# EAGLE schematic OSHintosh (EAGLE 9.7.0)
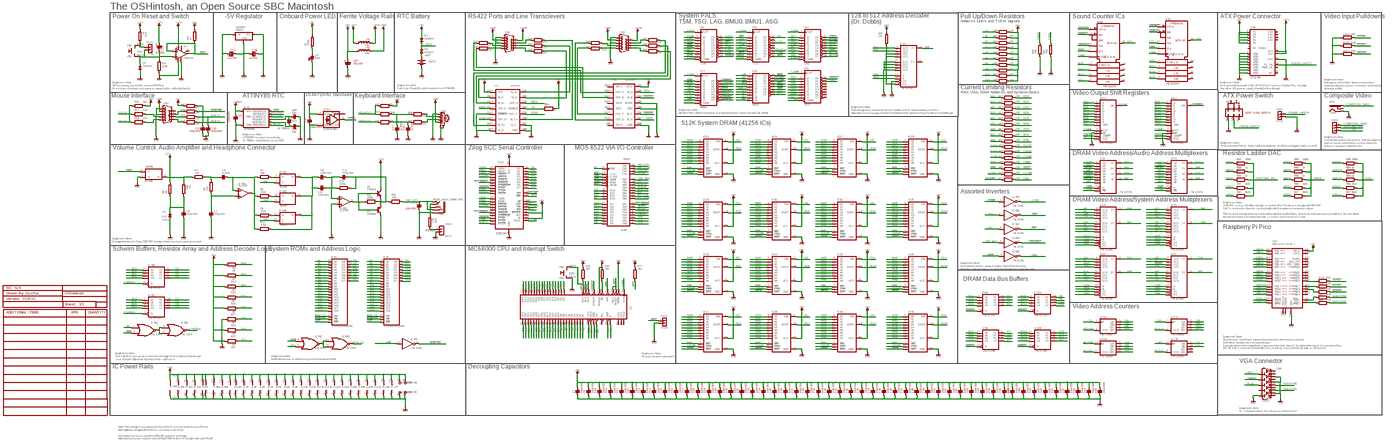
[diagram p0: schematic, sheet 1, overview]
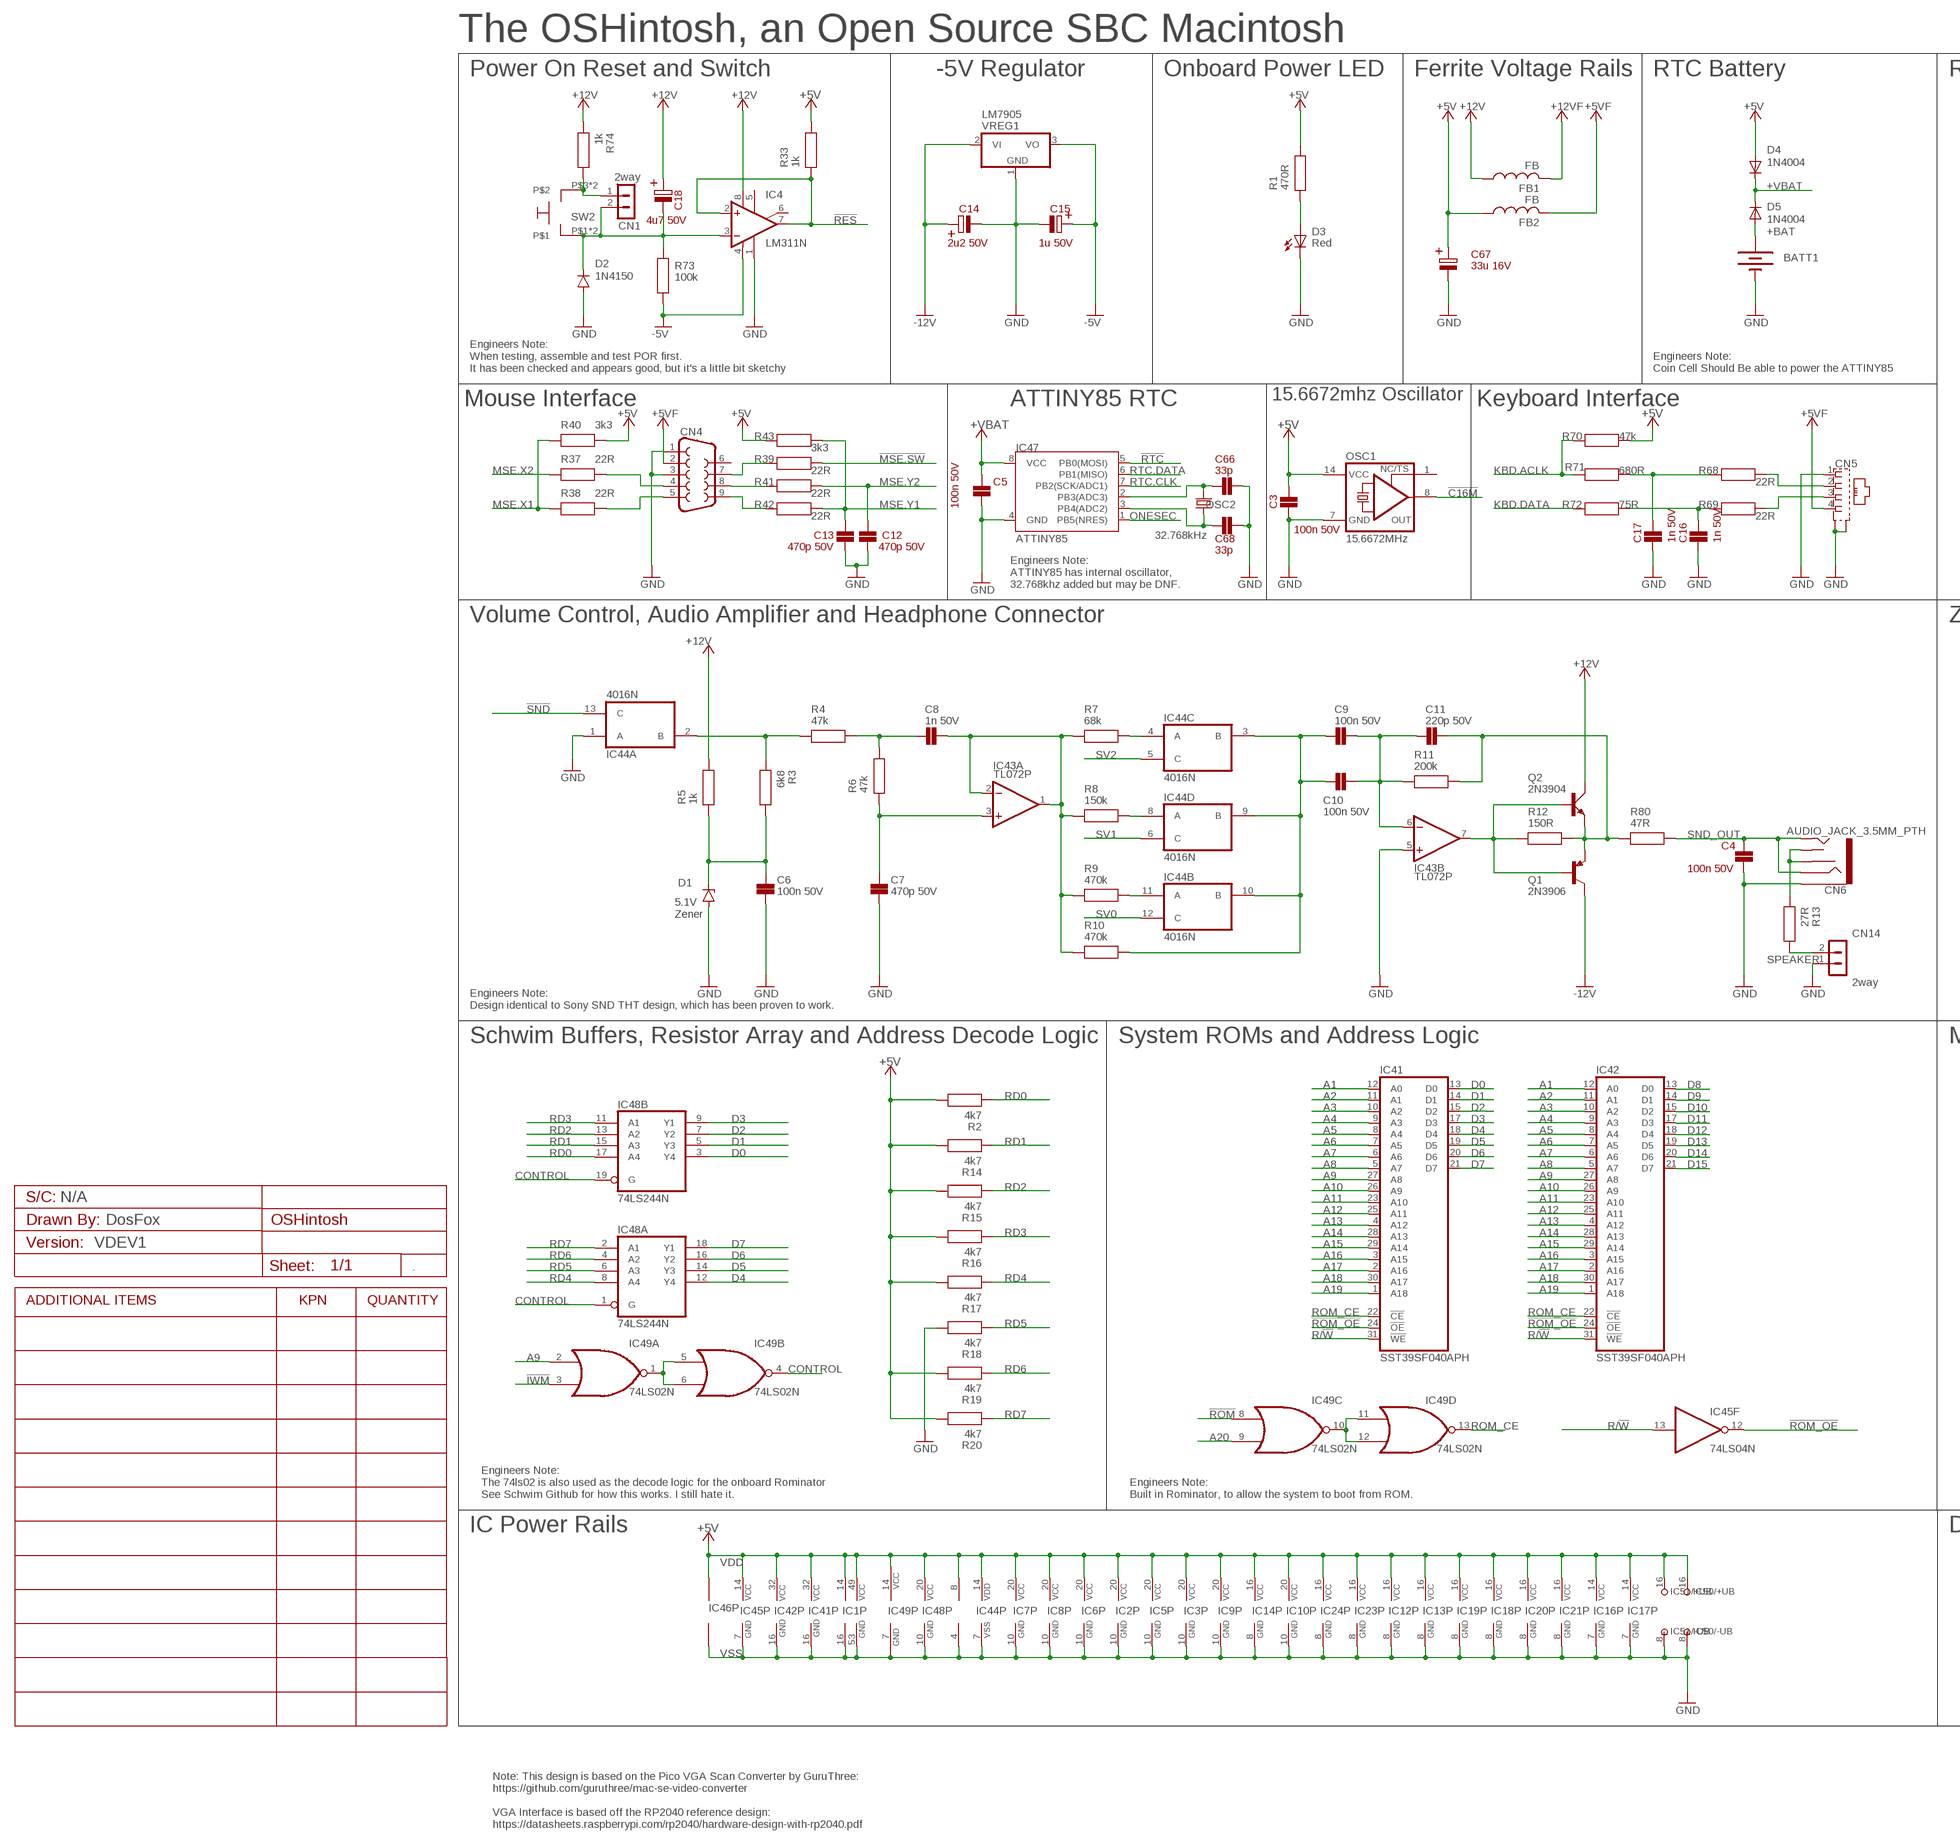
[diagram p1: schematic, sheet 1, part 1 of 4]
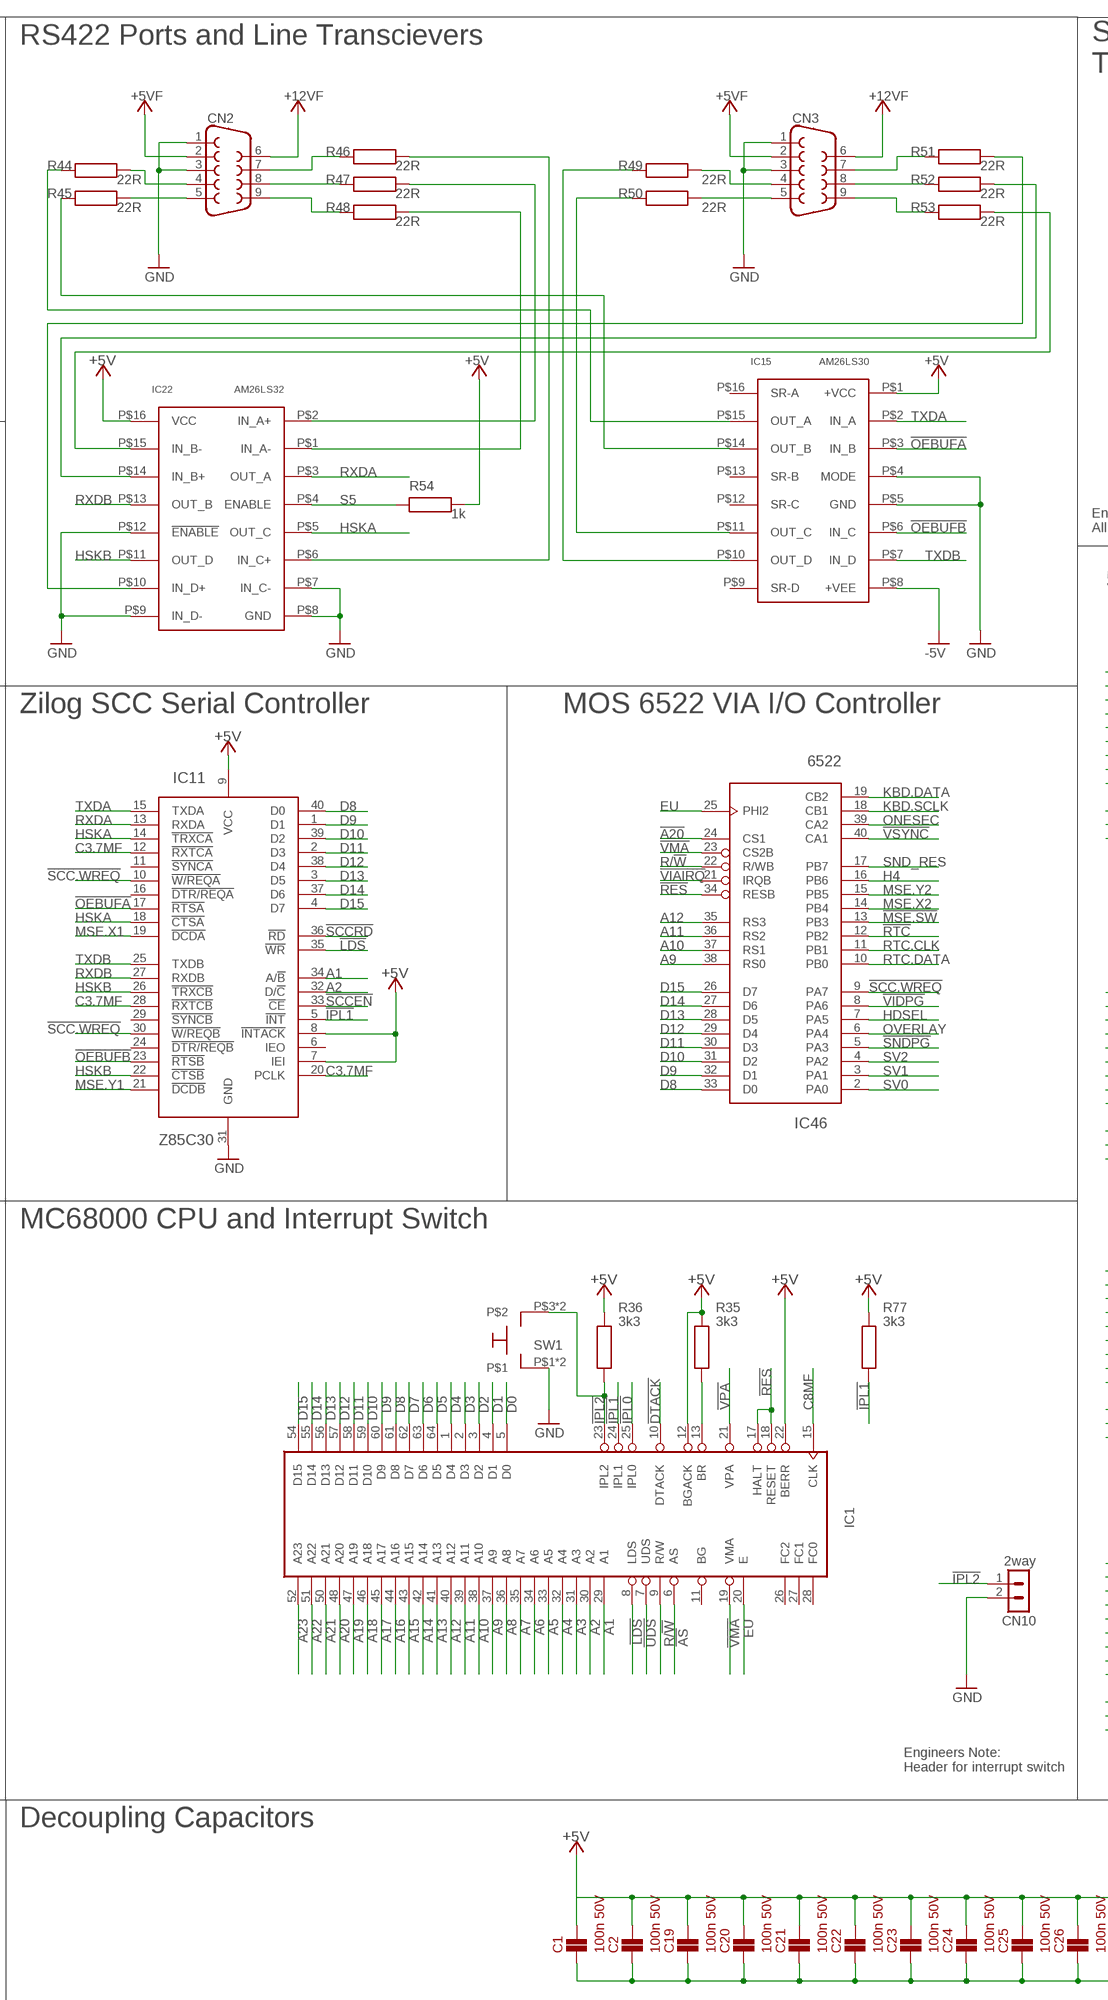
[diagram p2: schematic, sheet 1, part 2 of 4]
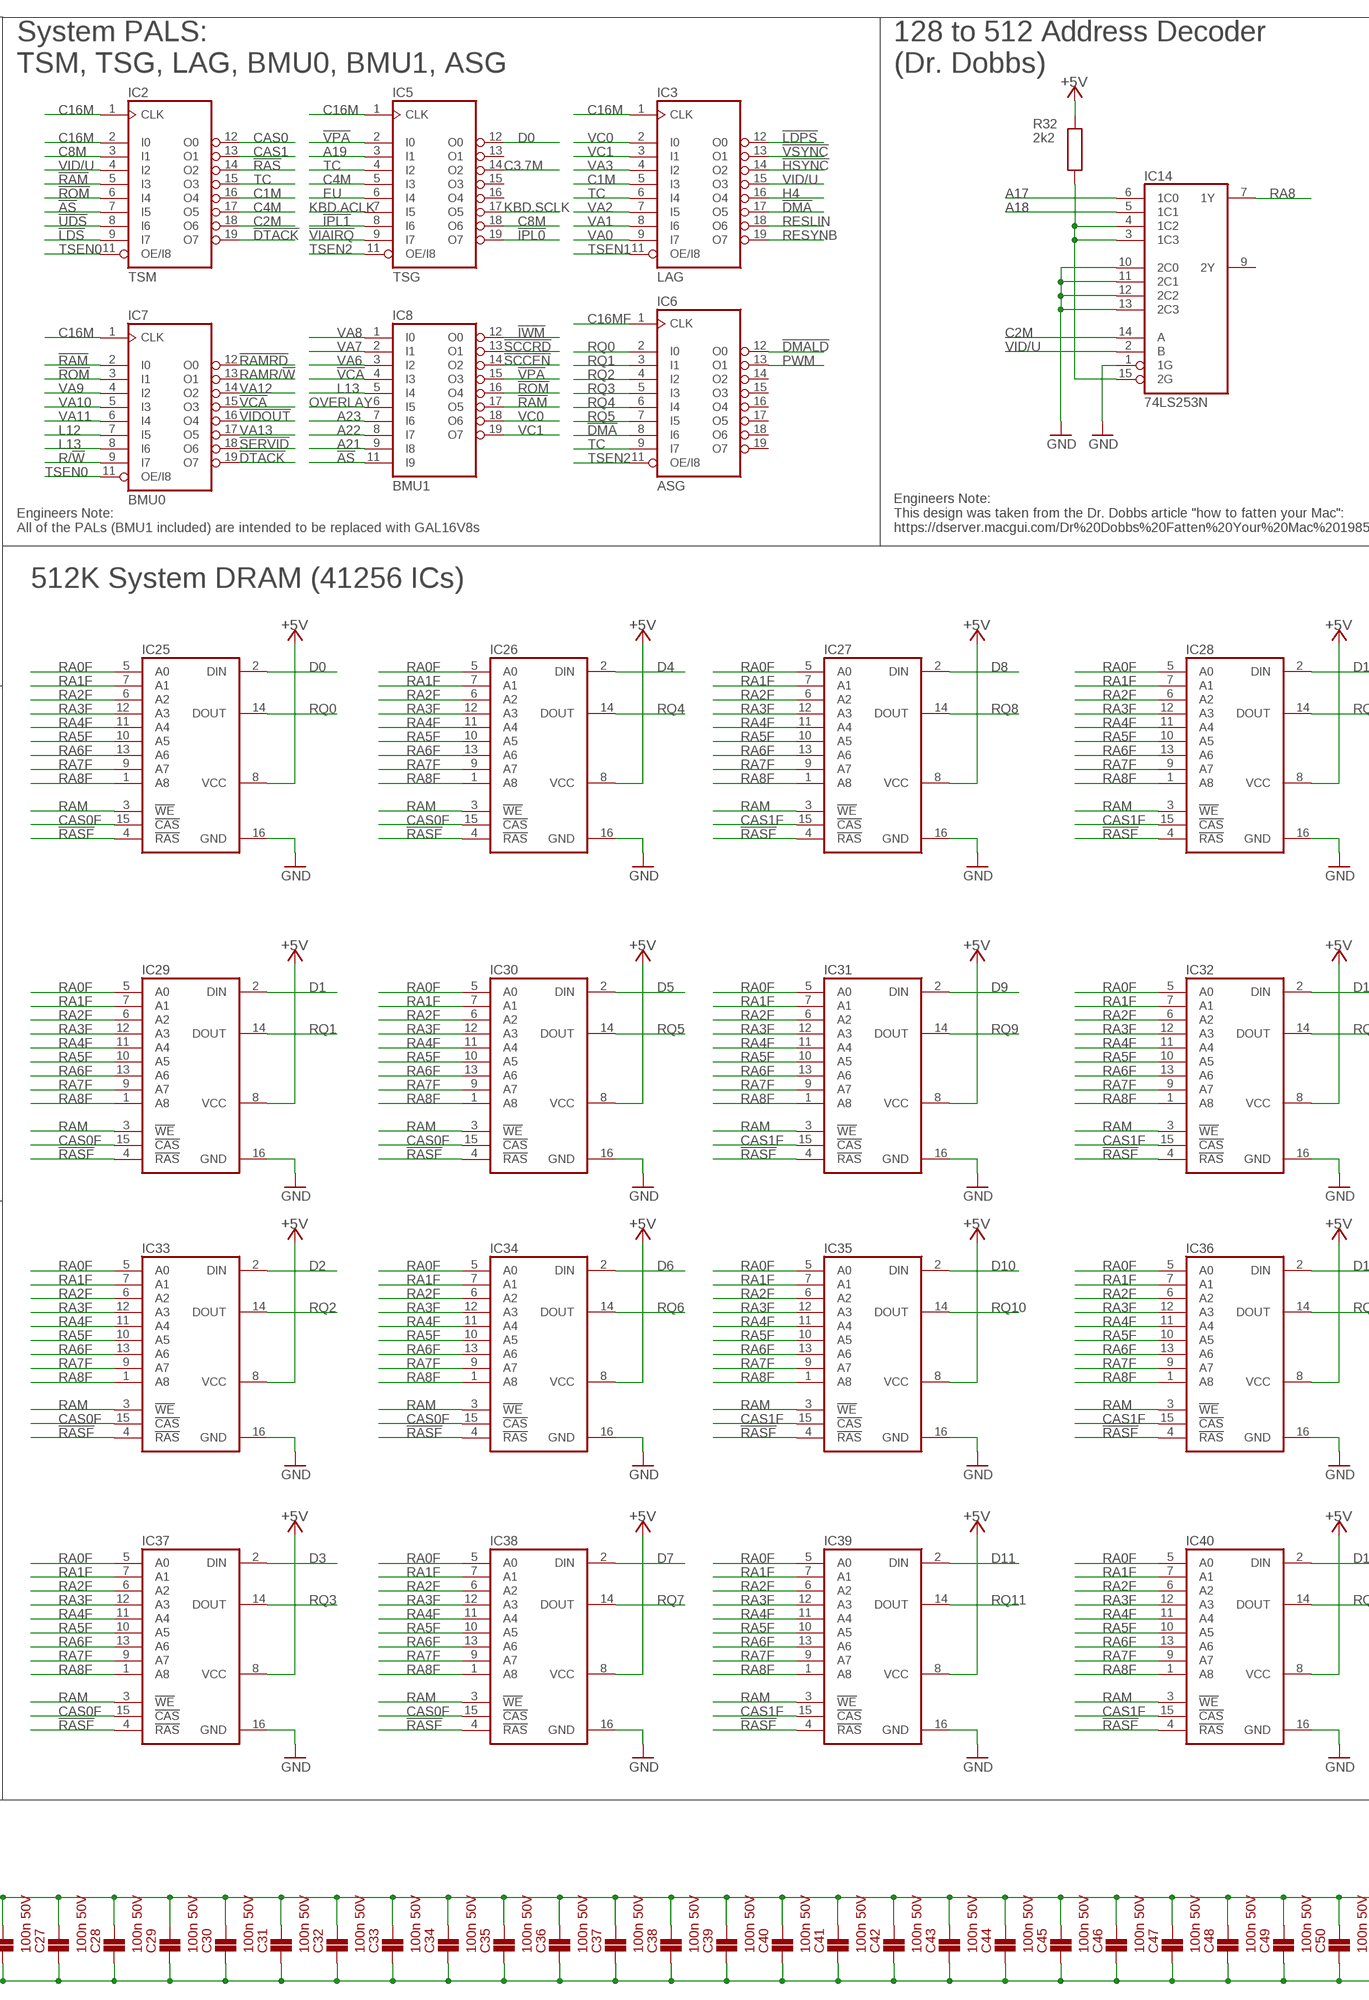
[diagram p3: schematic, sheet 1, part 3 of 4]
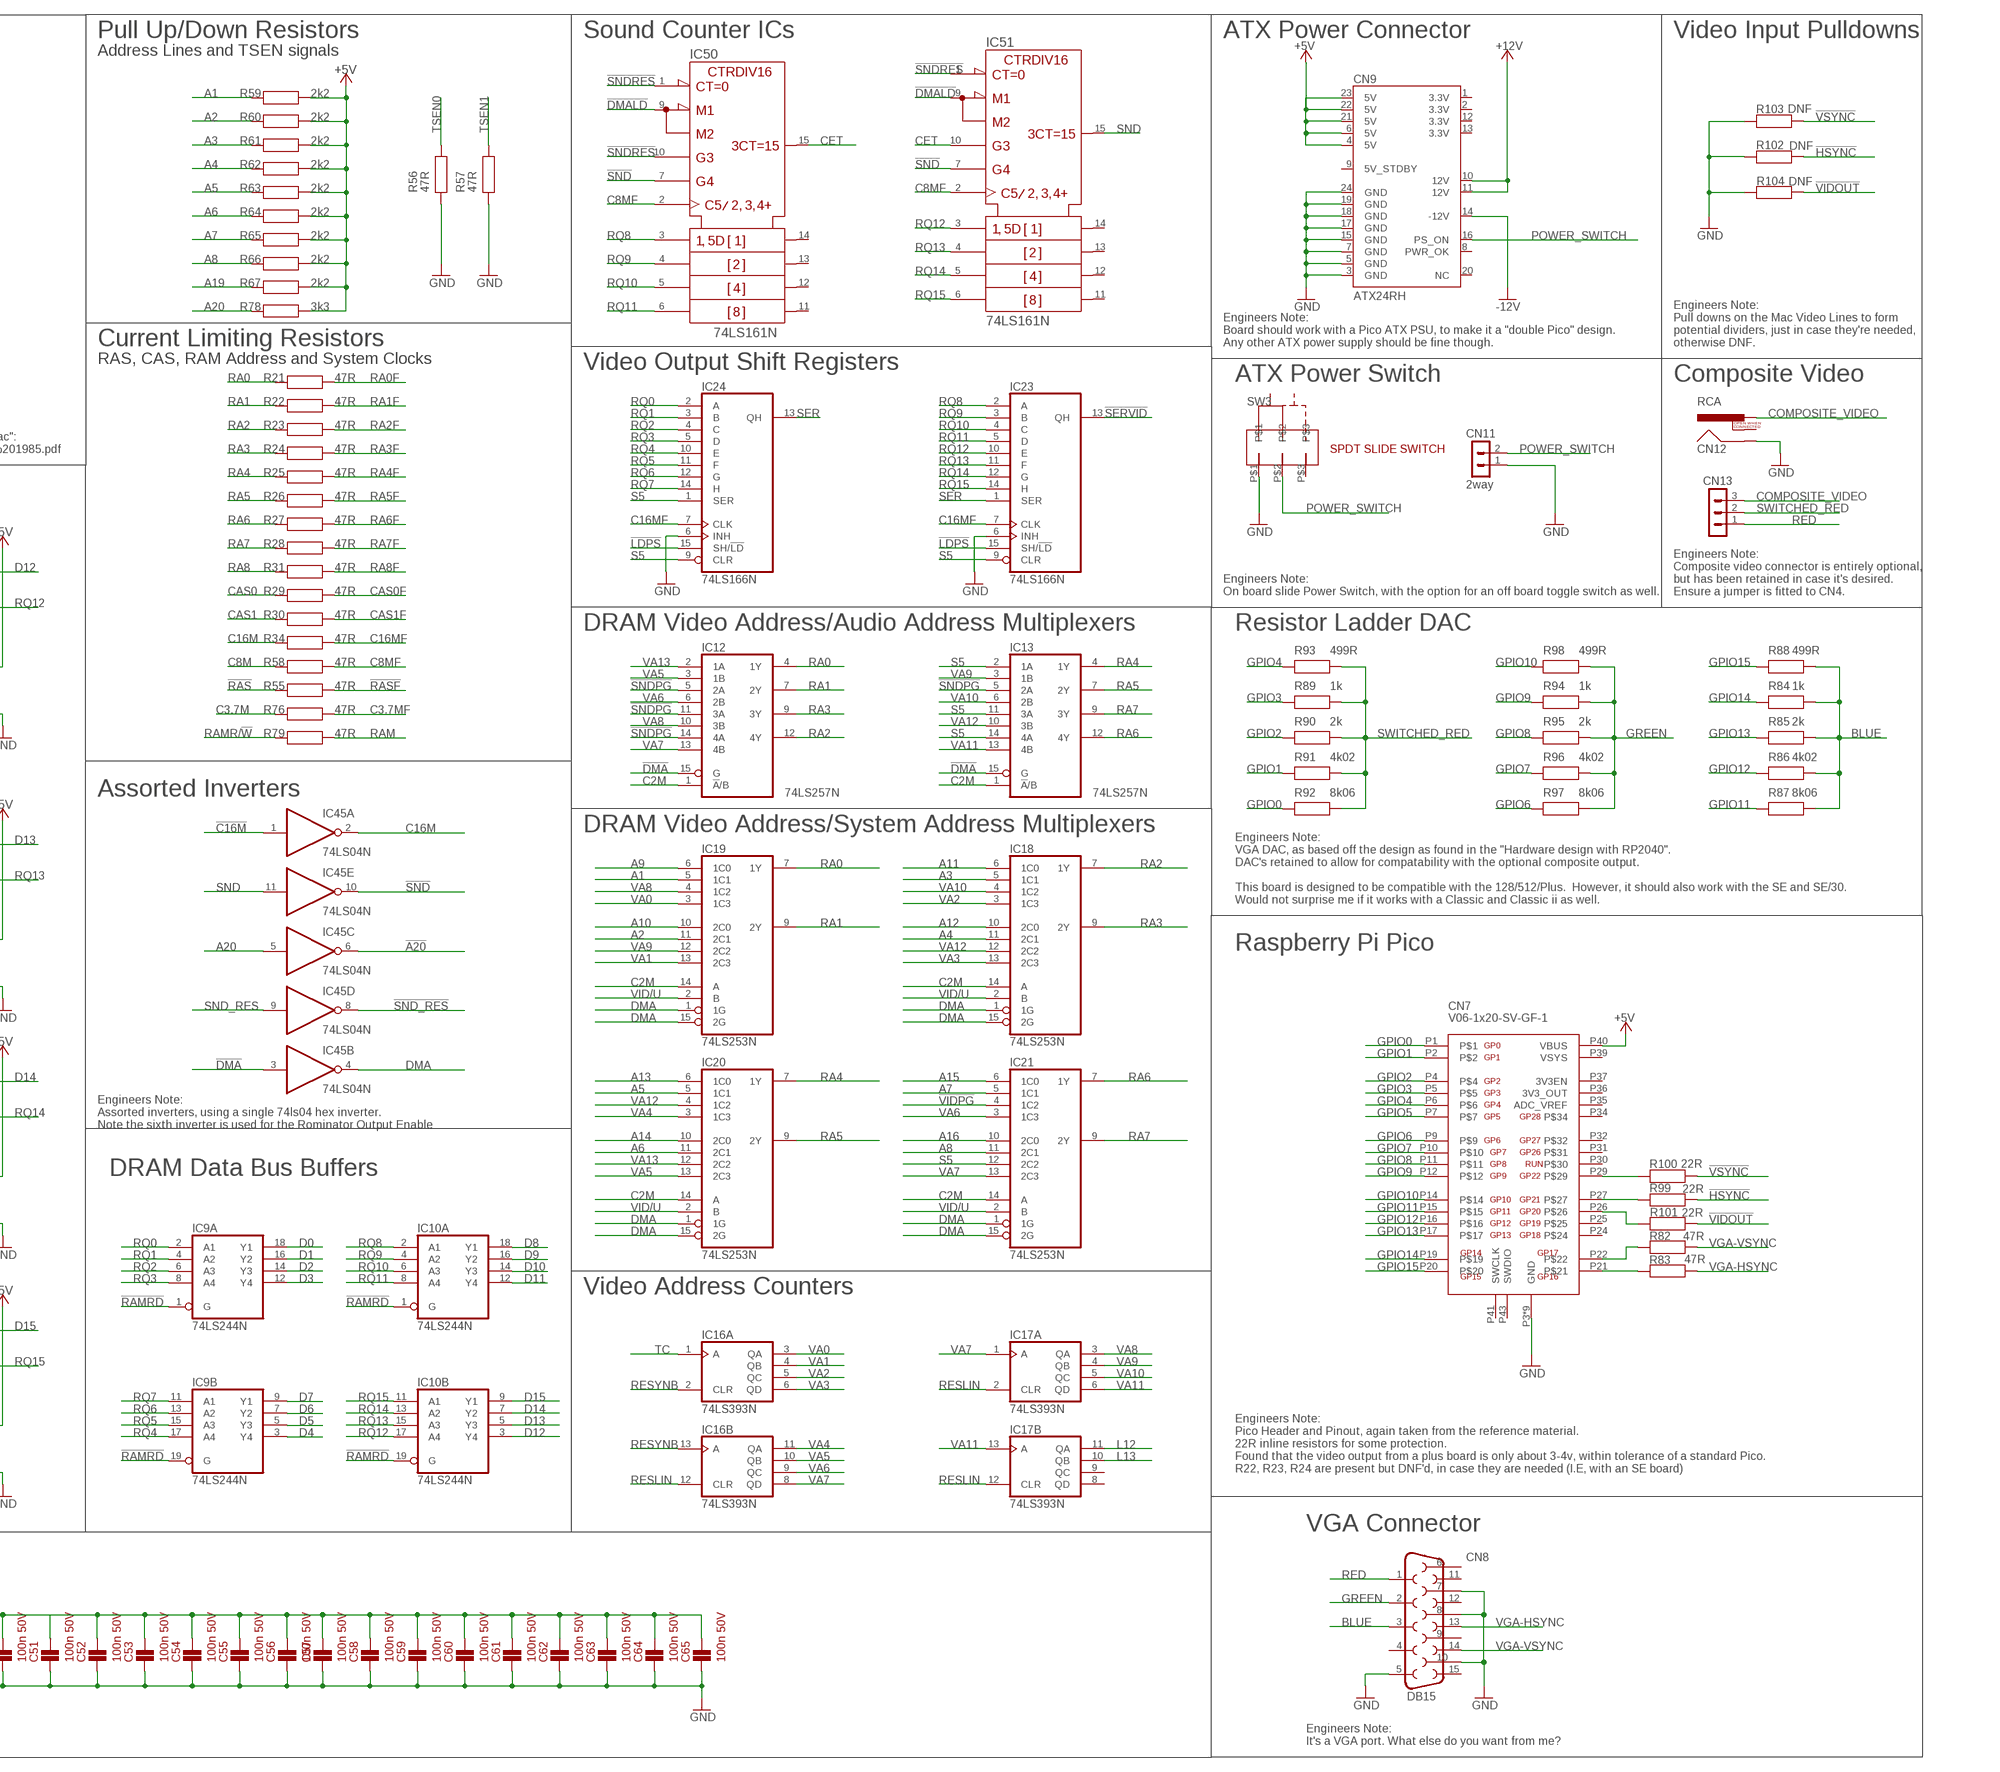
[diagram p4: schematic, sheet 1, part 4 of 4]

## Parts
A1  VDEV1  PROJECT_DETAILS_CUSTOM  [PCB_CUSTOM_DETAILS]
BATT1  BATTERY-20MM_PTH  [BATTCOM_20MM_PTH]
C1  100n 50V  100N_TH_CAP  [CAP_5.08MM_PITCH]
C2  100n 50V  100N_TH_CAP  [CAP_5.08MM_PITCH]
C3  100n 50V  100N_TH_CAP  [CAP_5.08MM_PITCH]
C4  100n 50V  100N_TH_CAP  [CAP_5.08MM_PITCH]
C5  100n 50V  100N_TH_CAP  [CAP_5.08MM_PITCH]
C6  100n 50V  100N_TH_CAP  [CAP_5.08MM_PITCH]
C7  470p 50V  470P_TH_CAP  [CAP_5.08MM_PITCH]
C8  1n 50V  1N_TH_CAP  [CAP_5.08MM_PITCH]
C9  100n 50V  100N_TH_CAP  [CAP_5.08MM_PITCH]
C10  100n 50V  100N_TH_CAP  [CAP_5.08MM_PITCH]
C11  220p 50V  220P_TH_CAP  [CAP_5.08MM_PITCH]
C12  470p 50V  470P_TH_CAP  [CAP_5.08MM_PITCH]
C13  470p 50V  470P_TH_CAP  [CAP_5.08MM_PITCH]
C14  2u2 50V  2U2_TH_ELEC_CAPVERTICAL  [CAP_ELECTROLYTIC]
C15  1u 50V  1U_TH_ELEC_CAPVERTICAL  [CAP_ELECTROLYTIC]
C16  1n 50V  1N_TH_CAP  [CAP_5.08MM_PITCH]
C17  1n 50V  1N_TH_CAP  [CAP_5.08MM_PITCH]
C18  4u7 50V  1U_TH_ELEC_CAPVERTICAL  [CAP_ELECTROLYTIC]
C19  100n 50V  100N_TH_CAP  [CAP_5.08MM_PITCH]
C20  100n 50V  100N_TH_CAP  [CAP_5.08MM_PITCH]
C21  100n 50V  100N_TH_CAP  [CAP_5.08MM_PITCH]
C22  100n 50V  100N_TH_CAP  [CAP_5.08MM_PITCH]
C23  100n 50V  100N_TH_CAP  [CAP_5.08MM_PITCH]
C24  100n 50V  100N_TH_CAP  [CAP_5.08MM_PITCH]
C25  100n 50V  100N_TH_CAP  [CAP_5.08MM_PITCH]
C26  100n 50V  100N_TH_CAP  [CAP_5.08MM_PITCH]
C27  100n 50V  100N_TH_CAP  [CAP_5.08MM_PITCH]
C28  100n 50V  100N_TH_CAP  [CAP_5.08MM_PITCH]
C29  100n 50V  100N_TH_CAP  [CAP_5.08MM_PITCH]
C30  100n 50V  100N_TH_CAP  [CAP_5.08MM_PITCH]
C31  100n 50V  100N_TH_CAP  [CAP_5.08MM_PITCH]
C32  100n 50V  100N_TH_CAP  [CAP_5.08MM_PITCH]
C33  100n 50V  100N_TH_CAP  [CAP_5.08MM_PITCH]
C34  100n 50V  100N_TH_CAP  [CAP_5.08MM_PITCH]
C35  100n 50V  100N_TH_CAP  [CAP_5.08MM_PITCH]
C36  100n 50V  100N_TH_CAP  [CAP_5.08MM_PITCH]
C37  100n 50V  100N_TH_CAP  [CAP_5.08MM_PITCH]
C38  100n 50V  100N_TH_CAP  [CAP_5.08MM_PITCH]
C39  100n 50V  100N_TH_CAP  [CAP_5.08MM_PITCH]
C40  100n 50V  100N_TH_CAP  [CAP_5.08MM_PITCH]
C41  100n 50V  100N_TH_CAP  [CAP_5.08MM_PITCH]
C42  100n 50V  100N_TH_CAP  [CAP_5.08MM_PITCH]
C43  100n 50V  100N_TH_CAP  [CAP_5.08MM_PITCH]
C44  100n 50V  100N_TH_CAP  [CAP_5.08MM_PITCH]
C45  100n 50V  100N_TH_CAP  [CAP_5.08MM_PITCH]
C46  100n 50V  100N_TH_CAP  [CAP_5.08MM_PITCH]
C47  100n 50V  100N_TH_CAP  [CAP_5.08MM_PITCH]
C48  100n 50V  100N_TH_CAP  [CAP_5.08MM_PITCH]
C49  100n 50V  100N_TH_CAP  [CAP_5.08MM_PITCH]
C50  100n 50V  100N_TH_CAP  [CAP_5.08MM_PITCH]
C51  100n 50V  100N_TH_CAP  [CAP_5.08MM_PITCH]
C52  100n 50V  100N_TH_CAP  [CAP_5.08MM_PITCH]
C53  100n 50V  100N_TH_CAP  [CAP_5.08MM_PITCH]
C54  100n 50V  100N_TH_CAP  [CAP_5.08MM_PITCH]
C55  100n 50V  100N_TH_CAP  [CAP_5.08MM_PITCH]
C56  100n 50V  100N_TH_CAP  [CAP_5.08MM_PITCH]
C57  100n 50V  100N_TH_CAP  [CAP_5.08MM_PITCH]
C58  100n 50V  100N_TH_CAP  [CAP_5.08MM_PITCH]
C59  100n 50V  100N_TH_CAP  [CAP_5.08MM_PITCH]
C60  100n 50V  100N_TH_CAP  [CAP_5.08MM_PITCH]
C61  100n 50V  100N_TH_CAP  [CAP_5.08MM_PITCH]
C62  100n 50V  100N_TH_CAP  [CAP_5.08MM_PITCH]
C63  100n 50V  100N_TH_CAP  [CAP_5.08MM_PITCH]
C64  100n 50V  100N_TH_CAP  [CAP_5.08MM_PITCH]
C65  100n 50V  100N_TH_CAP  [CAP_5.08MM_PITCH]
C66  33p  33P_TH_CAP  [CAP_5.08MM_PITCH]
C67  33u 16V  100U_TH_ELEC_CAPVERTICAL  [CAP_ELECTROLYTIC]
C68  33p  33P_TH_CAP  [CAP_5.08MM_PITCH]
CN1  2way  PIN_HEADER_2W_VERT_TH  [2W_2.54MM_PITCH_VERT_TH]
CN2  DB9FEMALE  [DB9]
CN3  DB9FEMALE  [DB9]
CN4  DB9FEMALE  [DB9]
CN5  XRJK-S-01-6-4-0-9M2  [XRJK-S-01-6-4-0-9M2]
CN6  AUDIO_JACK_3.5MM_PTH  [AUDIO-JACK]
CN7  V06-1x20-SV-GF-1  PICO_BOARD  [PICO_SOCKET]
CN8  DB15  [DB15]
CN9  ATX24RH  [ATX24_RIGHT_ANGLE]
CN10  2way  PIN_HEADER_2W_VERT_TH  [2W_2.54MM_PITCH_VERT_TH]
CN11  2way  PIN_HEADER_2W_VERT_TH  [2W_2.54MM_PITCH_VERT_TH]
CN12  RCA  [RCA]
CN13  V06-1x3-SV-GF-1  PIN_HEADER_3W_VERT_FEMALE_TH  [3W_2.54MM_PITCH_VERT_TH]
CN14  2way  PIN_HEADER_2W_VERT_TH  [2W_2.54MM_PITCH_VERT_TH]
D1  ZENER-DIODEF126-10  [F126Z10]
D2  1N4150  1N4148DO35-7  [DO35-7]
D3  Red  5MM_LED_RED  [5MM_TH_VERT_STANDARD]
D4  1N4004  [DO41-10]
D5  1N4004  [DO41-10]
FB1  FB  [FB]
FB2  FB  [FB]
IC1  MC68000P  [DIL64]
IC2  TSM  16V8  [DIL20]
IC3  LAG  16V8  [DIL20]
IC4  LM311N  [DIL08]
IC5  TSG  16V8  [DIL20]
IC6  ASG  16V8  [DIL20]
IC7  BMU0  16V8  [DIL20]
IC8  BMU1  16L8  [DIL20]
IC9  74LS244N  [DIL20]
IC10  74LS244N  [DIL20]
IC11  Z85C30  [DIP40]
IC12  74LS257N  [DIL16]
IC13  74LS257N  [DIL16]
IC14  74LS253N  [DIL16]
IC15  AM26LS30  [DIP16]
IC16  74LS393N  [DIL14]
IC17  74LS393N  [DIL14]
IC18  74LS253N  [DIL16]
IC19  74LS253N  [DIL16]
IC20  74LS253N  [DIL16]
IC21  74LS253N  [DIL16]
IC22  AM26LS32  [DIP16]
IC23  74LS166N  [DIL16]
IC24  74LS166N  [DIL16]
IC25  41256C/D  [DIL16]
IC26  41256C/D  [DIL16]
IC27  41256C/D  [DIL16]
IC28  41256C/D  [DIL16]
IC29  41256C/D  [DIL16]
IC30  41256C/D  [DIL16]
IC31  41256C/D  [DIL16]
IC32  41256C/D  [DIL16]
IC33  41256C/D  [DIL16]
IC34  41256C/D  [DIL16]
IC35  41256C/D  [DIL16]
IC36  41256C/D  [DIL16]
IC37  41256C/D  [DIL16]
IC38  41256C/D  [DIL16]
IC39  41256C/D  [DIL16]
IC40  41256C/D  [DIL16]
IC41  SST39SF040APH  [DIL32]
IC42  SST39SF040APH  [DIL32]
IC43  TL072P  [DIL08]
IC44  4016N  [DIL14]
IC45  74LS04N  [DIL14]
IC46  6522  G65SC22P  [DIP-40]
IC47  ATTINY85  ATTINY45TINY85-20-DIP  [DIP08_MCU]
IC48  74LS244N  [DIL20]
IC49  74LS02N  [DIL14]
IC50  74LS161N  74161N  [DIL16]
IC51  74LS161N  74161N  [DIL16]
OSC1  15.6672MHz  XO-14  [DIL14S]
OSC2  32.768kHz  CRYSTAL-32.768KHZPTH-2X6  [CRYSTAL-PTH-2X6-CYL]
Q1  2N3906  [TO92]
Q2  2N3904  [TO92D]
R1  470R  470R_TH_RESISTOR  [RESISTORTHRUHOLE]
R2  4k7  4K7_TH_RESISTOR  [RESISTORTHRUHOLE]
R3  6k8  6K8_TH_RESISTOR  [RESISTORTHRUHOLE]
R4  47k  47K_TH_RESISTOR  [RESISTORTHRUHOLE]
R5  1k  1K_TH_RESISTOR  [RESISTORTHRUHOLE]
R6  47k  47K_TH_RESISTOR  [RESISTORTHRUHOLE]
R7  68k  68K_TH_RESISTOR  [RESISTORTHRUHOLE]
R8  150k  150K_TH_RESISTOR  [RESISTORTHRUHOLE]
R9  470k  470K_TH_RESISTOR  [RESISTORTHRUHOLE]
R10  470k  470K_TH_RESISTOR  [RESISTORTHRUHOLE]
R11  200k  100K_TH_RESISTOR  [RESISTORTHRUHOLE]
R12  150R  150K_TH_RESISTOR  [RESISTORTHRUHOLE]
R13  27R  10R_TH_RESISTOR  [RESISTORTHRUHOLE]
R14  4k7  4K7_TH_RESISTOR  [RESISTORTHRUHOLE]
R15  4k7  4K7_TH_RESISTOR  [RESISTORTHRUHOLE]
R16  4k7  4K7_TH_RESISTOR  [RESISTORTHRUHOLE]
R17  4k7  4K7_TH_RESISTOR  [RESISTORTHRUHOLE]
R18  4k7  4K7_TH_RESISTOR  [RESISTORTHRUHOLE]
R19  4k7  4K7_TH_RESISTOR  [RESISTORTHRUHOLE]
R20  4k7  4K7_TH_RESISTOR  [RESISTORTHRUHOLE]
R21  47R  47R_TH_RESISTOR  [RESISTORTHRUHOLE]
R22  47R  47R_TH_RESISTOR  [RESISTORTHRUHOLE]
R23  47R  47R_TH_RESISTOR  [RESISTORTHRUHOLE]
R24  47R  47R_TH_RESISTOR  [RESISTORTHRUHOLE]
R25  47R  47R_TH_RESISTOR  [RESISTORTHRUHOLE]
R26  47R  47R_TH_RESISTOR  [RESISTORTHRUHOLE]
R27  47R  47R_TH_RESISTOR  [RESISTORTHRUHOLE]
R28  47R  47R_TH_RESISTOR  [RESISTORTHRUHOLE]
R29  47R  47R_TH_RESISTOR  [RESISTORTHRUHOLE]
R30  47R  47R_TH_RESISTOR  [RESISTORTHRUHOLE]
R31  47R  47R_TH_RESISTOR  [RESISTORTHRUHOLE]
R32  2k2  2K2_TH_RESISTOR  [RESISTORTHRUHOLE]
R33  1k  1K_TH_RESISTOR  [RESISTORTHRUHOLE]
R34  47R  47R_TH_RESISTOR  [RESISTORTHRUHOLE]
R35  3k3  3K3_TH_RESISTOR  [RESISTORTHRUHOLE]
R36  3k3  3K3_TH_RESISTOR  [RESISTORTHRUHOLE]
R37  22R  22R_TH_RESISTOR  [RESISTORTHRUHOLE]
R38  22R  22R_TH_RESISTOR  [RESISTORTHRUHOLE]
R39  22R  22R_TH_RESISTOR  [RESISTORTHRUHOLE]
R40  3k3  3K3_TH_RESISTOR  [RESISTORTHRUHOLE]
R41  22R  22R_TH_RESISTOR  [RESISTORTHRUHOLE]
R42  22R  22R_TH_RESISTOR  [RESISTORTHRUHOLE]
R43  3k3  3K3_TH_RESISTOR  [RESISTORTHRUHOLE]
R44  22R  22R_TH_RESISTOR  [RESISTORTHRUHOLE]
R45  22R  22R_TH_RESISTOR  [RESISTORTHRUHOLE]
R46  22R  22R_TH_RESISTOR  [RESISTORTHRUHOLE]
R47  22R  22R_TH_RESISTOR  [RESISTORTHRUHOLE]
R48  22R  22R_TH_RESISTOR  [RESISTORTHRUHOLE]
R49  22R  22R_TH_RESISTOR  [RESISTORTHRUHOLE]
R50  22R  22R_TH_RESISTOR  [RESISTORTHRUHOLE]
R51  22R  22R_TH_RESISTOR  [RESISTORTHRUHOLE]
R52  22R  22R_TH_RESISTOR  [RESISTORTHRUHOLE]
R53  22R  22R_TH_RESISTOR  [RESISTORTHRUHOLE]
R54  1k  1K_TH_RESISTOR  [RESISTORTHRUHOLE]
R55  47R  47R_TH_RESISTOR  [RESISTORTHRUHOLE]
R56  47R  47R_TH_RESISTOR  [RESISTORTHRUHOLE]
R57  47R  47R_TH_RESISTOR  [RESISTORTHRUHOLE]
R58  47R  47R_TH_RESISTOR  [RESISTORTHRUHOLE]
R59  2k2  2K2_TH_RESISTOR  [RESISTORTHRUHOLE]
R60  2k2  2K2_TH_RESISTOR  [RESISTORTHRUHOLE]
R61  2k2  2K2_TH_RESISTOR  [RESISTORTHRUHOLE]
R62  2k2  2K2_TH_RESISTOR  [RESISTORTHRUHOLE]
R63  2k2  2K2_TH_RESISTOR  [RESISTORTHRUHOLE]
R64  2k2  2K2_TH_RESISTOR  [RESISTORTHRUHOLE]
R65  2k2  2K2_TH_RESISTOR  [RESISTORTHRUHOLE]
R66  2k2  2K2_TH_RESISTOR  [RESISTORTHRUHOLE]
R67  2k2  2K2_TH_RESISTOR  [RESISTORTHRUHOLE]
R68  22R  22R_TH_RESISTOR  [RESISTORTHRUHOLE]
R69  22R  22R_TH_RESISTOR  [RESISTORTHRUHOLE]
R70  47k  47K_TH_RESISTOR  [RESISTORTHRUHOLE]
R71  680R  680R_TH_RESISTOR  [RESISTORTHRUHOLE]
R72  75R  22R_TH_RESISTOR  [RESISTORTHRUHOLE]
R73  100k  100K_TH_RESISTOR  [RESISTORTHRUHOLE]
R74  1k  1K_TH_RESISTOR  [RESISTORTHRUHOLE]
R76  47R  47R_TH_RESISTOR  [RESISTORTHRUHOLE]
R77  3k3  3K3_TH_RESISTOR  [RESISTORTHRUHOLE]
R78  3k3  3K3_TH_RESISTOR  [RESISTORTHRUHOLE]
R79  47R  47R_TH_RESISTOR  [RESISTORTHRUHOLE]
R80  47R  47R_TH_RESISTOR  [RESISTORTHRUHOLE]
R82  47R  47R_TH_RESISTOR  [RESISTORTHRUHOLE]
R83  47R  47R_TH_RESISTOR  [RESISTORTHRUHOLE]
R84  1k  1K_TH_RESISTOR  [RESISTORTHRUHOLE]
R85  2k  2K2_TH_RESISTOR  [RESISTORTHRUHOLE]
R86  4k02  4K7_TH_RESISTOR  [RESISTORTHRUHOLE]
R87  8k06  68K_TH_RESISTOR  [RESISTORTHRUHOLE]
R88  499R  470R_TH_RESISTOR  [RESISTORTHRUHOLE]
R89  1k  1K_TH_RESISTOR  [RESISTORTHRUHOLE]
R90  2k  2K2_TH_RESISTOR  [RESISTORTHRUHOLE]
R91  4k02  4K7_TH_RESISTOR  [RESISTORTHRUHOLE]
R92  8k06  68K_TH_RESISTOR  [RESISTORTHRUHOLE]
R93  499R  470R_TH_RESISTOR  [RESISTORTHRUHOLE]
R94  1k  1K_TH_RESISTOR  [RESISTORTHRUHOLE]
R95  2k  2K2_TH_RESISTOR  [RESISTORTHRUHOLE]
R96  4k02  4K7_TH_RESISTOR  [RESISTORTHRUHOLE]
R97  8k06  68K_TH_RESISTOR  [RESISTORTHRUHOLE]
R98  499R  470R_TH_RESISTOR  [RESISTORTHRUHOLE]
R99  22R  22R_TH_RESISTOR  [RESISTORTHRUHOLE]
R100  22R  22R_TH_RESISTOR  [RESISTORTHRUHOLE]
R101  22R  22R_TH_RESISTOR  [RESISTORTHRUHOLE]
R102  DNF  22R_TH_RESISTOR  [RESISTORTHRUHOLE]
R103  DNF  22R_TH_RESISTOR  [RESISTORTHRUHOLE]
R104  DNF  22R_TH_RESISTOR  [RESISTORTHRUHOLE]
SW1  DTS-61  DIP_TACT_SWITCH_6X6TH  [DIP_DTS_6_TACT_SWITCH_6X6_TH]
SW2  DTS-61  DIP_TACT_SWITCH_6X6TH  [DIP_DTS_6_TACT_SWITCH_6X6_TH]
SW3  SS12D16-GDN5  [THRUHOLE90DEGSLIDESW]
VREG1  LM7905  7905T  [TO220H]

## Nets
!A20: IC45.6(C:O) IC46.24(CS1)
!AS: IC1.6(AS) IC2.7(I5) IC8.11(I9)
!C16M: IC45.1(A:I) OSC1.8(OUT)
!DMA: IC3.17(O5) IC6.8(I6) IC12.15(G) IC13.15(G) IC45.3(B:I)
!DMALD: IC6.12(O0) IC50.9(!LOAD) IC51.9(!LOAD)
!DTACK: IC1.10(DTACK) IC2.19(O7) IC7.19(O7)
!HSYNC: IC3.14(O2) R99.P$2 R102.P$2
!IPL0: IC1.25(IPL0) IC5.19(O7)
!IPL1: IC1.24(IPL1) IC5.8(I6) IC11.5(!INT) R77.P$1
!IPL2: CN10.1 IC1.23(IPL2) R36.P$1 SW1.P$3 SW1.P$4
!IWM: IC8.12(O0) IC49.3(A:I1)
!LDPS: IC3.12(O0) IC23.15(SH/!LD) IC24.15(SH/!LD)
!LDS: IC1.8(LDS) IC2.9(I7) IC11.35(!WR)
!MSE.SW: IC46.13(PB3) R39.P$2
!OEBUFA: IC11.17(!RTSA) IC15.P$3(IN_B)
!OEBUFB: IC11.23(!RTSB) IC15.P$6(IN_C)
!RAM: IC2.5(I3) IC7.2(I0) IC8.17(O5)
!RAMRD: IC7.12(O0) IC9.1(A:G) IC9.19(B:G) IC10.1(A:G) IC10.19(B:G)
!RAS: IC2.14(O2) R55.P$1
!RASF: IC25.4(!RAS) IC26.4(!RAS) IC27.4(!RAS) IC28.4(!RAS) IC29.4(!RAS) IC30.4(!RAS) IC31.4(!RAS) IC32.4(!RAS) IC33.4(!RAS) IC34.4(!RAS) IC35.4(!RAS) IC36.4(!RAS) IC37.4(!RAS) IC38.4(!RAS) IC39.4(!RAS) IC40.4(!RAS) R55.P$2
!RES: IC1.17(HALT) IC1.18(RESET) IC4.2(+IN) IC4.7(OUT) IC46.34(RESB) R33.P$1
!ROM: IC2.6(I4) IC7.3(I1) IC8.16(O4) IC49.8(C:I0)
!ROM_OE: IC41.24(!OE) IC42.24(!OE) IC45.12(F:O)
!RTC: IC46.12(PB2) IC47.5(PB0(MOSI))
!SCC.WREQ: IC11.10(!W/REQA) IC11.30(!W/REQB) IC46.9(PA7)
!SCCEN: IC8.14(O2) IC11.33(!CE)
!SCCRD: IC8.13(O1) IC11.36(!RD)
!SERVID: IC7.18(O6) IC23.13(QH)
!SND: IC44.13(A:C) IC45.10(E:O) IC50.7(ENP) IC51.7(ENP)
!SND_RES: IC45.8(D:O)
!SNDPG: IC12.5(2A) IC12.11(3A) IC12.14(4A) IC13.5(2A) IC46.5(PA3)
!SNDRES: IC50.1(!CLR) IC50.10(ENT) IC51.1(!CLR)
!UDS: IC1.7(UDS) IC2.8(I6)
!VCA: IC7.15(O3) IC8.4(I3)
!VIAIRQ: IC5.9(I7) IC46.21(IRQB)
!VIDOUT: IC7.16(O4) R101.P$2 R104.P$2
!VIDPG: IC21.4(1C2) IC46.8(PA6)
!VMA: IC1.19(VMA) IC46.23(CS2B)
!VPA: IC1.21(VPA) IC5.2(I0) IC8.15(O3)
!VSYNC: IC3.13(O1) IC46.40(CA1) R100.P$2 R103.P$2
+5V: C1.P$2 C2.P$2 C3.P$2 C19.P$2 C20.P$2 C21.P$2 C22.P$2 C23.P$2 C24.P$2 C25.P$2 C26.P$2 C27.P$2 C28.P$2 C29.P$2 C30.P$2 C31.P$2 C32.P$2 C33.P$2 C34.P$2 C35.P$2 C36.P$2 C37.P$2 C38.P$2 C39.P$2 C40.P$2 C41.P$2 C42.P$2 C43.P$2 C44.P$2 C45.P$2 C46.P$2 C47.P$2 C48.P$2 C49.P$2 C50.P$2 C51.P$2 C52.P$2 C53.P$2 C54.P$2 C55.P$2 C56.P$2 C57.P$2 C58.P$2 C59.P$2 C60.P$2 C61.P$2 C62.P$2 C63.P$2 C64.P$2 C65.P$2 C67.P$1 CN7.P40(VBUS) CN9.4(5V) CN9.6(5V) CN9.21(5V) CN9.22(5V) CN9.23(5V) D4.A FB2.P$1 IC1.12(BGACK) IC1.14(VCC) IC1.22(BERR) IC1.49(VCC) IC2.20(VCC) IC3.20(VCC) IC5.20(VCC) IC6.20(VCC) IC7.20(VCC) IC8.20(VCC) IC9.20(P:VCC) IC10.20(P:VCC) IC11.7(IEI) IC11.8(!INTACK) IC11.9(VCC) IC12.16(VCC) IC13.16(VCC) IC14.16(VCC) IC15.P$1(+VCC) IC16.14(P:VCC) IC17.14(P:VCC) IC18.16(VCC) IC19.16(VCC) IC20.16(VCC) IC21.16(VCC) IC22.P$16(VCC) IC23.16(VCC) IC24.16(VCC) IC25.8(VCC) IC26.8(VCC) IC27.8(VCC) IC28.8(VCC) IC29.8(VCC) IC30.8(VCC) IC31.8(VCC) IC32.8(VCC) IC33.8(VCC) IC34.8(VCC) IC35.8(VCC) IC36.8(VCC) IC37.8(VCC) IC38.8(VCC) IC39.8(VCC) IC40.8(VCC) IC41.32(VCC) IC42.32(VCC) IC43.8(P:V+) IC44.14(P:VDD) IC45.14(P:VCC) IC46.20(VDD) IC48.20(P:VCC) IC49.14(P:VCC) IC50.16(+UB) IC51.16(+UB) OSC1.14(VCC) R1.P$2 R2.P$2 R14.P$2 R15.P$2 R16.P$2 R17.P$2 R19.P$2 R20.P$2 R32.P$2 R33.P$2 R35.P$2 R36.P$2 R40.P$2 R43.P$2 R54.P$1 R59.P$2 R60.P$2 R61.P$2 R62.P$2 R63.P$2 R64.P$2 R65.P$2 R66.P$2 R67.P$2 R70.P$2 R77.P$2 R78.P$2 ; supply symbol labelled 3V3, VCC
+5VF: CN2.2 CN3.2 CN4.2 CN5.4 FB2.P$2 ; supply symbol labelled 3V3, VCC
+12V: C18.P$1 CN9.10(12V) CN9.11(12V) FB1.P$1 IC4.8(V+) Q2.C R5.P$2 R74.P$1 ; supply symbol labelled VCC, 3V3
+12VF: CN2.6 CN3.6 FB1.P$2 ; supply symbol labelled 3V3
+BAT: BATT1.1(+) D5.A
+VBAT: C5.P$2 D4.C D5.C IC47.8(VCC) ; supply symbol labelled VCC
-5V: C15.P$1 IC4.4(V-) IC15.P$8(+VEE) R73.P$1 VREG1.3(VO) ; supply symbol labelled GND
-12V: C14.P$1 CN9.14(-12V) Q1.1(C) VREG1.2(VI) ; supply symbol labelled GND
A1: IC1.29(A1) IC11.34(A/!B) IC19.5(1C1) IC41.12(A0) IC42.12(A0) R59.P$1
A2: IC1.30(A2) IC11.32(D/!C) IC19.11(2C1) IC41.11(A1) IC42.11(A1) R60.P$1
A3: IC1.31(A3) IC18.5(1C1) IC41.10(A2) IC42.10(A2) R61.P$1
A4: IC1.32(A4) IC18.11(2C1) IC41.9(A3) IC42.9(A3) R62.P$1
A5: IC1.33(A5) IC20.5(1C1) IC41.8(A4) IC42.8(A4) R63.P$1
A6: IC1.34(A6) IC20.11(2C1) IC41.7(A5) IC42.7(A5) R64.P$1
A7: IC1.35(A7) IC21.5(1C1) IC41.6(A6) IC42.6(A6) R65.P$1
A8: IC1.36(A8) IC21.11(2C1) IC41.5(A7) IC42.5(A7) R66.P$1
A9: IC1.37(A9) IC19.6(1C0) IC41.27(A8) IC42.27(A8) IC46.38(RS0) IC49.2(A:I0)
A10: IC1.38(A10) IC19.10(2C0) IC41.26(A9) IC42.26(A9) IC46.37(RS1)
A11: IC1.39(A11) IC18.6(1C0) IC41.23(A10) IC42.23(A10) IC46.36(RS2)
A12: IC1.40(A12) IC18.10(2C0) IC41.25(A11) IC42.25(A11) IC46.35(RS3)
A13: IC1.41(A13) IC20.6(1C0) IC41.4(A12) IC42.4(A12)
A14: IC1.42(A14) IC20.10(2C0) IC41.28(A13) IC42.28(A13)
A15: IC1.43(A15) IC21.6(1C0) IC41.29(A14) IC42.29(A14)
A16: IC1.44(A16) IC21.10(2C0) IC41.3(A15) IC42.3(A15)
A17: IC1.45(A17) IC14.6(1C0) IC41.2(A16) IC42.2(A16)
A18: IC1.46(A18) IC14.5(1C1) IC41.30(A17) IC42.30(A17)
A19: IC1.47(A19) IC5.3(I1) IC41.1(A18) IC42.1(A18) R67.P$1
A20: IC1.48(A20) IC45.5(C:I) IC49.9(C:I1) R78.P$1
A21: IC1.50(A21) IC8.9(I8)
A22: IC1.51(A22) IC8.8(I7)
A23: IC1.52(A23) IC8.7(I6)
BLUE: CN8.3 R84.P$2 R85.P$2 R86.P$2 R87.P$2 R88.P$2
C1M: IC2.16(O4) IC3.5(I3)
C2M: IC2.18(O6) IC12.1(!A!/B) IC13.1(!A!/B) IC14.14(A) IC18.14(A) IC19.14(A) IC20.14(A) IC21.14(A)
C3.7M: IC5.14(O2) R76.P$1
C3.7MF: IC11.12(!RXTCA) IC11.20(PCLK) IC11.28(!RXTCB) R76.P$2
C4M: IC2.17(O5) IC5.5(I3)
C8M: IC2.3(I1) IC5.18(O6) R58.P$1
C8MF: IC1.15(CLK) IC50.2(CLK) IC51.2(CLK) R58.P$2
C16M: IC2.1(CLK) IC2.2(I0) IC3.1(CLK) IC5.1(CLK) IC7.1(CLK) IC45.2(A:O) R34.P$1
C16MF: IC6.1(CLK) IC23.7(CLK) IC24.7(CLK) R34.P$2
CAS0: IC2.12(O0) R29.P$1
CAS0F: IC25.15(!CAS) IC26.15(!CAS) IC29.15(!CAS) IC30.15(!CAS) IC33.15(!CAS) IC34.15(!CAS) IC37.15(!CAS) IC38.15(!CAS) R29.P$2
CAS1: IC2.13(O1) R30.P$1
CAS1F: IC27.15(!CAS) IC28.15(!CAS) IC31.15(!CAS) IC32.15(!CAS) IC35.15(!CAS) IC36.15(!CAS) IC39.15(!CAS) IC40.15(!CAS) R30.P$2
CET: IC50.15(RCO) IC51.10(ENT)
COMPOSITE_VIDEO: CN12.PIN CN13.3
CONTROL: IC48.1(A:G) IC48.19(B:G) IC49.4(B:O)
D0: IC1.5(D0) IC5.12(O0) IC9.18(A:Y1) IC25.2(DIN) IC41.13(D0) IC48.3(B:Y4)
D1: IC1.4(D1) IC9.16(A:Y2) IC29.2(DIN) IC41.14(D1) IC48.5(B:Y3)
D2: IC1.3(D2) IC9.14(A:Y3) IC33.2(DIN) IC41.15(D2) IC48.7(B:Y2)
D3: IC1.2(D3) IC9.12(A:Y4) IC37.2(DIN) IC41.17(D3) IC48.9(B:Y1)
D4: IC1.1(D4) IC9.3(B:Y4) IC26.2(DIN) IC41.18(D4) IC48.12(A:Y4)
D5: IC1.64(D5) IC9.5(B:Y3) IC30.2(DIN) IC41.19(D5) IC48.14(A:Y3)
D6: IC1.63(D6) IC9.7(B:Y2) IC34.2(DIN) IC41.20(D6) IC48.16(A:Y2)
D7: IC1.62(D7) IC9.9(B:Y1) IC38.2(DIN) IC41.21(D7) IC48.18(A:Y1)
D8: IC1.61(D8) IC10.18(A:Y1) IC11.40(D0) IC27.2(DIN) IC42.13(D0) IC46.33(D0)
D9: IC1.60(D9) IC10.16(A:Y2) IC11.1(D1) IC31.2(DIN) IC42.14(D1) IC46.32(D1)
D10: IC1.59(D10) IC10.14(A:Y3) IC11.39(D2) IC35.2(DIN) IC42.15(D2) IC46.31(D2)
D11: IC1.58(D11) IC10.12(A:Y4) IC11.2(D3) IC39.2(DIN) IC42.17(D3) IC46.30(D3)
D12: IC1.57(D12) IC10.3(B:Y4) IC11.38(D4) IC28.2(DIN) IC42.18(D4) IC46.29(D4)
D13: IC1.56(D13) IC10.5(B:Y3) IC11.3(D5) IC32.2(DIN) IC42.19(D5) IC46.28(D5)
D14: IC1.55(D14) IC10.7(B:Y2) IC11.37(D6) IC36.2(DIN) IC42.20(D6) IC46.27(D6)
D15: IC1.54(D15) IC10.9(B:Y1) IC11.4(D7) IC40.2(DIN) IC42.21(D7) IC46.26(D7)
DMA: IC18.1(1G) IC18.15(2G) IC19.1(1G) IC19.15(2G) IC20.1(1G) IC20.15(2G) IC21.1(1G) IC21.15(2G) IC45.4(B:O)
EU: IC1.20(E) IC5.6(I4) IC46.25(PHI2)
GND: BATT1.2(-) C1.P$1 C2.P$1 C3.P$1 C4.P$2 C5.P$1 C6.P$1 C7.P$1 C12.P$1 C13.P$1 C14.P$2 C15.P$2 C16.P$1 C17.P$1 C19.P$1 C20.P$1 C21.P$1 C22.P$1 C23.P$1 C24.P$1 C25.P$1 C26.P$1 C27.P$1 C28.P$1 C29.P$1 C30.P$1 C31.P$1 C32.P$1 C33.P$1 C34.P$1 C35.P$1 C36.P$1 C37.P$1 C38.P$1 C39.P$1 C40.P$1 C41.P$1 C42.P$1 C43.P$1 C44.P$1 C45.P$1 C46.P$1 C47.P$1 C48.P$1 C49.P$1 C50.P$1 C51.P$1 C52.P$1 C53.P$1 C54.P$1 C55.P$1 C56.P$1 C57.P$1 C58.P$1 C59.P$1 C60.P$1 C61.P$1 C62.P$1 C63.P$1 C64.P$1 C65.P$1 C66.P$2 C67.P$2 C68.P$2 CN2.1 CN2.3 CN3.1 CN3.3 CN4.1 CN4.3 CN5.1 CN5.S1(S) CN5.S2(S) CN6.SLEEVE CN7.P3(GND) CN7.P8(GND) CN7.P13(GND) CN7.P18(GND) CN7.P23(GND) CN7.P28(GND) CN7.P33(GND) CN7.P38(GND) CN7.P42(GND) CN8.5 CN8.7 CN8.8 CN8.10 CN9.3(GND) CN9.5(GND) CN9.7(GND) CN9.15(GND) CN9.17(GND) CN9.18(GND) CN9.19(GND) CN9.24(GND) CN10.2 CN11.1 CN12.SHELL CN14.1 D1.A D2.A D3.C IC1.16(GND) IC1.53(GND) IC2.10(GND) IC3.10(GND) IC4.1(GND) IC5.10(GND) IC6.10(GND) IC7.10(GND) IC8.10(GND) IC9.10(P:GND) IC10.10(P:GND) IC11.31(GND) IC12.8(GND) IC13.8(GND) IC14.1(1G) IC14.8(GND) IC14.10(2C0) IC14.11(2C1) IC14.12(2C2) IC14.13(2C3) IC15.P$4(MODE) IC15.P$5(GND) IC16.7(P:GND) IC17.7(P:GND) IC18.8(GND) IC19.8(GND) IC20.8(GND) IC21.8(GND) IC22.P$7(IN_C-) IC22.P$8(GND) IC22.P$9(IN_D-) IC22.P$12(!ENABLE) IC23.6(INH) IC23.8(GND) IC24.6(INH) IC24.8(GND) IC25.16(GND) IC26.16(GND) IC27.16(GND) IC28.16(GND) IC29.16(GND) IC30.16(GND) IC31.16(GND) IC32.16(GND) IC33.16(GND) IC34.16(GND) IC35.16(GND) IC36.16(GND) IC37.16(GND) IC38.16(GND) IC39.16(GND) IC40.16(GND) IC41.16(GND) IC42.16(GND) IC43.4(P:V-) IC43.5(B:+IN) IC44.1(A:A) IC44.7(P:VSS) IC45.7(P:GND) IC46.1(VSS) IC47.4(GND) IC48.10(P:GND) IC49.7(P:GND) IC50.8(-UB) IC51.8(-UB) OSC1.7(GND) R18.P$2 R56.P$1 R57.P$1 R102.P$1 R103.P$1 R104.P$1 SW1.P$1 SW1.P$2 SW3.P$1 VREG1.1(GND)
GPIO0: CN7.P1 R92.P$1
GPIO1: CN7.P2 R91.P$1
GPIO2: CN7.P4 R90.P$1
GPIO3: CN7.P5 R89.P$1
GPIO4: CN7.P6 R93.P$1
GPIO5: CN7.P7
GPIO6: CN7.P9 R97.P$1
GPIO7: CN7.P10 R96.P$1
GPIO8: CN7.P11 R95.P$1
GPIO9: CN7.P12 R94.P$1
GPIO10: CN7.P14 R98.P$1
GPIO11: CN7.P15 R87.P$1
GPIO12: CN7.P16 R86.P$1
GPIO13: CN7.P17 R85.P$1
GPIO14: CN7.P19 R84.P$1
GPIO15: CN7.P20 R88.P$1
GREEN: CN8.2 R94.P$2 R95.P$2 R96.P$2 R97.P$2 R98.P$2
H4: IC3.16(O4) IC46.16(PB6)
HDSEL: IC46.7(PA5)
HSKA: IC11.14(!TRXCA) IC11.18(!CTSA) IC22.P$5(OUT_C)
HSKB: IC11.22(!CTSB) IC11.26(!TRXCB) IC22.P$11(OUT_D)
KBD.ACLK: IC5.7(I5) R70.P$1 R71.P$2
KBD.DATA: IC46.19(CB2) R72.P$1
KBD.SCLK: IC5.17(O5) IC46.18(CB1)
L12: IC7.7(I5) IC17.11(B:QA)
L13: IC7.8(I6) IC8.5(I4) IC17.10(B:QB)
MSE.X1: IC11.19(!DCDA) R38.P$1 R40.P$1
MSE.X2: IC46.14(PB4) R37.P$1
MSE.Y1: C13.P$2 IC11.21(!DCDB) R42.P$2 R43.P$1
MSE.Y2: C12.P$2 IC46.15(PB5) R41.P$2
N$1: D3.A R1.P$1
N$2: IC44.2(A:B) R3.P$1 R4.P$1
N$3: C9.P$1 C10.P$1 IC44.3(C:B) IC44.9(D:B) IC44.10(B:B) R10.P$2
N$4: C8.P$1 R4.P$2 R6.P$2
N$5: C6.P$2 D1.C R3.P$2 R5.P$1
N$6: C7.P$2 IC43.3(A:+IN) R6.P$1
N$7: IC44.4(C:A) R7.P$2
N$8: IC44.8(D:A) R8.P$2
N$9: IC44.11(B:A) R9.P$2
N$10: C9.P$2 C10.P$2 C11.P$1 IC43.6(B:-IN) R11.P$1
N$12: C8.P$2 IC43.1(A:OUT) IC43.2(A:-IN) R7.P$1 R8.P$1 R9.P$1 R10.P$1
N$13: C11.P$2 Q1.3(E) Q2.E R11.P$2 R12.P$2 R80.P$1
N$14: IC49.1(A:O) IC49.5(B:I0) IC49.6(B:I1)
N$15: IC43.7(B:OUT) Q1.2(B) Q2.B R12.P$1
N$16: IC49.10(C:O) IC49.11(D:I0) IC49.12(D:I1)
N$17: IC14.3(1C3) IC14.4(1C2) IC14.15(2G) R32.P$1
N$18: IC1.13(BR) R35.P$1
N$19: CN6.RSH CN6.TSH R13.P$1
N$20: CN4.5 R38.P$2
N$21: CN4.4 R37.P$2
N$22: CN4.7 R39.P$1
N$23: C66.P$1 IC47.2(PB3(ADC3)) OSC2.2
N$24: C68.P$1 IC47.3(PB4(ADC2)) OSC2.1
N$25: CN4.8 R41.P$1
N$26: CN4.9 R42.P$1
N$27: CN5.2 R68.P$2
N$28: IC15.P$14(OUT_B) R45.P$1
N$29: IC22.P$6(IN_C+) R46.P$2
N$30: CN2.4 R44.P$2
N$31: CN2.5 R45.P$2
N$32: IC22.P$2(IN_A+) R47.P$2
N$33: CN2.7 R46.P$1
N$34: CN2.8 R47.P$1
N$35: CN2.9 R48.P$1
N$36: IC22.P$1(IN_A-) R48.P$2
N$37: CN3.4 R49.P$2
N$38: CN3.5 R50.P$2
N$39: CN3.7 R51.P$1
N$40: CN3.8 R52.P$1
N$41: CN3.9 R53.P$1
N$42: IC15.P$10(OUT_D) R49.P$1
N$43: IC15.P$11(OUT_C) R50.P$1
N$44: IC22.P$10(IN_D+) R51.P$2
N$45: IC22.P$14(IN_B+) R52.P$2
N$46: IC22.P$15(IN_B-) R53.P$2
N$47: IC15.P$15(OUT_A) R44.P$1
N$48: CN5.3 R69.P$2
N$49: C17.P$2 R68.P$1 R71.P$1
N$50: C16.P$2 R69.P$1 R72.P$2
N$51: C18.P$2 CN1.2 D2.C IC4.3(-IN) R73.P$2 SW2.P$1 SW2.P$2
N$52: CN1.1 R74.P$2 SW2.P$3 SW2.P$4
N$54: CN7.P22 R82.P$1
N$55: CN7.P21 R83.P$1
N$56: CN7.P29 R100.P$1
N$57: CN7.P27 R99.P$1
N$58: CN7.P26 R101.P$1
ONESEC: IC46.39(CA2) IC47.1(PB5(NRES))
OVERLAY: IC8.6(I5) IC46.6(PA4)
POWER_SWITCH: CN9.16(PS_ON) CN11.2 SW3.P$2
PWM: IC6.13(O1)
R/!W: IC1.9(R/W) IC7.9(I7) IC41.31(!WE) IC42.31(!WE) IC45.13(F:I) IC46.22(R/WB)
RA0: IC12.4(1Y) IC19.7(1Y) R21.P$1
RA0F: IC25.5(A0) IC26.5(A0) IC27.5(A0) IC28.5(A0) IC29.5(A0) IC30.5(A0) IC31.5(A0) IC32.5(A0) IC33.5(A0) IC34.5(A0) IC35.5(A0) IC36.5(A0) IC37.5(A0) IC38.5(A0) IC39.5(A0) IC40.5(A0) R21.P$2
RA1: IC12.7(2Y) IC19.9(2Y) R22.P$1
RA1F: IC25.7(A1) IC26.7(A1) IC27.7(A1) IC28.7(A1) IC29.7(A1) IC30.7(A1) IC31.7(A1) IC32.7(A1) IC33.7(A1) IC34.7(A1) IC35.7(A1) IC36.7(A1) IC37.7(A1) IC38.7(A1) IC39.7(A1) IC40.7(A1) R22.P$2
RA2: IC12.12(4Y) IC18.7(1Y) R23.P$1
RA2F: IC25.6(A2) IC26.6(A2) IC27.6(A2) IC28.6(A2) IC29.6(A2) IC30.6(A2) IC31.6(A2) IC32.6(A2) IC33.6(A2) IC34.6(A2) IC35.6(A2) IC36.6(A2) IC37.6(A2) IC38.6(A2) IC39.6(A2) IC40.6(A2) R23.P$2
RA3: IC12.9(3Y) IC18.9(2Y) R24.P$1
RA3F: IC25.12(A3) IC26.12(A3) IC27.12(A3) IC28.12(A3) IC29.12(A3) IC30.12(A3) IC31.12(A3) IC32.12(A3) IC33.12(A3) IC34.12(A3) IC35.12(A3) IC36.12(A3) IC37.12(A3) IC38.12(A3) IC39.12(A3) IC40.12(A3) R24.P$2
RA4: IC13.4(1Y) IC20.7(1Y) R25.P$1
RA4F: IC25.11(A4) IC26.11(A4) IC27.11(A4) IC28.11(A4) IC29.11(A4) IC30.11(A4) IC31.11(A4) IC32.11(A4) IC33.11(A4) IC34.11(A4) IC35.11(A4) IC36.11(A4) IC37.11(A4) IC38.11(A4) IC39.11(A4) IC40.11(A4) R25.P$2
RA5: IC13.7(2Y) IC20.9(2Y) R26.P$1
RA5F: IC25.10(A5) IC26.10(A5) IC27.10(A5) IC28.10(A5) IC29.10(A5) IC30.10(A5) IC31.10(A5) IC32.10(A5) IC33.10(A5) IC34.10(A5) IC35.10(A5) IC36.10(A5) IC37.10(A5) IC38.10(A5) IC39.10(A5) IC40.10(A5) R26.P$2
RA6: IC13.12(4Y) IC21.7(1Y) R27.P$1
RA6F: IC25.13(A6) IC26.13(A6) IC27.13(A6) IC28.13(A6) IC29.13(A6) IC30.13(A6) IC31.13(A6) IC32.13(A6) IC33.13(A6) IC34.13(A6) IC35.13(A6) IC36.13(A6) IC37.13(A6) IC38.13(A6) IC39.13(A6) IC40.13(A6) R27.P$2
RA7: IC13.9(3Y) IC21.9(2Y) R28.P$1
RA7F: IC25.9(A7) IC26.9(A7) IC27.9(A7) IC28.9(A7) IC29.9(A7) IC30.9(A7) IC31.9(A7) IC32.9(A7) IC33.9(A7) IC34.9(A7) IC35.9(A7) IC36.9(A7) IC37.9(A7) IC38.9(A7) IC39.9(A7) IC40.9(A7) R28.P$2
RA8: IC14.7(1Y) R31.P$1
RA8F: IC25.1(A8) IC26.1(A8) IC27.1(A8) IC28.1(A8) IC29.1(A8) IC30.1(A8) IC31.1(A8) IC32.1(A8) IC33.1(A8) IC34.1(A8) IC35.1(A8) IC36.1(A8) IC37.1(A8) IC38.1(A8) IC39.1(A8) IC40.1(A8) R31.P$2
RAM: IC25.3(!WE) IC26.3(!WE) IC27.3(!WE) IC28.3(!WE) IC29.3(!WE) IC30.3(!WE) IC31.3(!WE) IC32.3(!WE) IC33.3(!WE) IC34.3(!WE) IC35.3(!WE) IC36.3(!WE) IC37.3(!WE) IC38.3(!WE) IC39.3(!WE) IC40.3(!WE) R79.P$2
RAMR/!W: IC7.13(O1) R79.P$1
RD0: IC48.17(B:A4) R2.P$1
RD1: IC48.15(B:A3) R14.P$1
RD2: IC48.13(B:A2) R15.P$1
RD3: IC48.11(B:A1) R16.P$1
RD4: IC48.8(A:A4) R17.P$1
RD5: IC48.6(A:A3) R18.P$1
RD6: IC48.4(A:A2) R19.P$1
RD7: IC48.2(A:A1) R20.P$1
RED: CN8.1 CN13.1
RESLIN: IC3.18(O6) IC16.12(B:CLR) IC17.2(A:CLR) IC17.12(B:CLR)
RESYNB: IC3.19(O7) IC16.2(A:CLR) IC16.13(B:A)
ROM_CE: IC41.22(!CE) IC42.22(!CE) IC49.13(D:O)
RQ0: IC6.2(I0) IC9.2(A:A1) IC24.2(A) IC25.14(DOUT)
RQ1: IC6.3(I1) IC9.4(A:A2) IC24.3(B) IC29.14(DOUT)
RQ2: IC6.4(I2) IC9.6(A:A3) IC24.4(C) IC33.14(DOUT)
RQ3: IC6.5(I3) IC9.8(A:A4) IC24.5(D) IC37.14(DOUT)
RQ4: IC6.6(I4) IC9.17(B:A4) IC24.10(E) IC26.14(DOUT)
RQ5: IC6.7(I5) IC9.15(B:A3) IC24.11(F) IC30.14(DOUT)
RQ6: IC9.13(B:A2) IC24.12(G) IC34.14(DOUT)
RQ7: IC9.11(B:A1) IC24.14(H) IC38.14(DOUT)
RQ8: IC10.2(A:A1) IC23.2(A) IC27.14(DOUT) IC50.3(A)
RQ9: IC10.4(A:A2) IC23.3(B) IC31.14(DOUT) IC50.4(B)
RQ10: IC10.6(A:A3) IC23.4(C) IC35.14(DOUT) IC50.5(C)
RQ11: IC10.8(A:A4) IC23.5(D) IC39.14(DOUT) IC50.6(D)
RQ12: IC10.17(B:A4) IC23.10(E) IC28.14(DOUT) IC51.3(A)
RQ13: IC10.15(B:A3) IC23.11(F) IC32.14(DOUT) IC51.4(B)
RQ14: IC10.13(B:A2) IC23.12(G) IC36.14(DOUT) IC51.5(C)
RQ15: IC10.11(B:A1) IC23.14(H) IC40.14(DOUT) IC51.6(D)
RTC.CLK: IC46.11(PB1) IC47.7(PB2(SCK/ADC1))
RTC.DATA: IC46.10(PB0) IC47.6(PB1(MISO))
RXDA: IC11.13(RXDA) IC22.P$3(OUT_A)
RXDB: IC11.27(RXDB) IC22.P$13(OUT_B)
S5: IC13.2(1A) IC13.11(3A) IC13.14(4A) IC21.12(2C2) IC22.P$4(ENABLE) IC23.9(CLR) IC24.1(SER) IC24.9(CLR) R54.P$2
SER: IC23.1(SER) IC24.13(QH)
SND: IC45.11(E:I) IC51.15(RCO)
SND_OUT: C4.P$1 CN6.RING CN6.TIP R80.P$2
SND_RES: IC45.9(D:I) IC46.17(PB7)
SPEAKER: CN14.2 R13.P$2
SV0: IC44.12(B:C) IC46.2(PA0)
SV1: IC44.6(D:C) IC46.3(PA1)
SV2: IC44.5(C:C) IC46.4(PA2)
SWITCHED_RED: CN13.2 R89.P$2 R90.P$2 R91.P$2 R92.P$2 R93.P$2
TC: IC2.15(O3) IC3.6(I4) IC5.4(I2) IC6.9(I7) IC16.1(A:A)
TSEN0: IC2.11(OE/I8) IC7.11(OE/I8) R56.P$2
TSEN1: IC3.11(OE/I8) R57.P$2
TSEN2: IC5.11(OE/I8) IC6.11(OE/I8)
TXDA: IC11.15(TXDA) IC15.P$2(IN_A)
TXDB: IC11.25(TXDB) IC15.P$7(IN_D)
VA0: IC3.9(I7) IC16.3(A:QA) IC19.3(1C3)
VA1: IC3.8(I6) IC16.4(A:QB) IC19.13(2C3)
VA2: IC3.7(I5) IC16.5(A:QC) IC18.3(1C3)
VA3: IC3.4(I2) IC16.6(A:QD) IC18.13(2C3)
VA4: IC16.11(B:QA) IC20.3(1C3)
VA5: IC12.3(1B) IC16.10(B:QB) IC20.13(2C3)
VA6: IC8.3(I2) IC12.6(2B) IC16.9(B:QC) IC21.3(1C3)
VA7: IC8.2(I1) IC12.13(4B) IC16.8(B:QD) IC17.1(A:A) IC21.13(2C3)
VA8: IC8.1(I0) IC12.10(3B) IC17.3(A:QA) IC19.4(1C2)
VA9: IC7.4(I2) IC13.3(1B) IC17.4(A:QB) IC19.12(2C2)
VA10: IC7.5(I3) IC13.6(2B) IC17.5(A:QC) IC18.4(1C2)
VA11: IC7.6(I4) IC13.13(4B) IC17.6(A:QD) IC17.13(B:A)
VA12: IC7.14(O2) IC13.10(3B) IC18.12(2C2) IC20.4(1C2)
VA13: IC7.17(O5) IC12.2(1A) IC20.12(2C2)
VC0: IC3.2(I0) IC8.18(O6)
VC1: IC3.3(I1) IC8.19(O7)
VGA-HSYNC: CN8.13 R83.P$2
VGA-VSYNC: CN8.14 R82.P$2
VID/U: IC2.4(I2) IC3.15(O3) IC14.2(B) IC18.2(B) IC19.2(B) IC20.2(B) IC21.2(B)
Unconnected: CN4.6 CN7.P24 CN7.P25 CN7.P30 CN7.P31 CN7.P32 CN7.P34 CN7.P35(ADC_VREF) CN7.P36(3V3_OUT) CN7.P37(3V3EN) CN7.P39(VSYS) CN7.P41(SWCLK) CN7.P43(SWDIO) CN8.4 CN8.6 CN8.9 CN8.11 CN8.12 CN8.15 CN9.1(3.3V) CN9.2(3.3V) CN9.8(PWR_OK) CN9.9(5V_STDBY) CN9.12(3.3V) CN9.13(3.3V) CN9.20(NC) CN12.SWITCH IC1.11(BG) IC1.26(FC2) IC1.27(FC1) IC1.28(FC0) IC4.5(ON) IC4.6(ON/STR) IC5.13(O1) IC5.15(O3) IC5.16(O4) IC6.14(O2) IC6.15(O3) IC6.16(O4) IC6.17(O5) IC6.18(O6) IC6.19(O7) IC11.6(IEO) IC11.11(!SYNCA) IC11.16(!DTR/REQA) IC11.24(!DTR/REQB) IC11.29(!SYNCB) IC14.9(2Y) IC15.P$9(SR-D) IC15.P$12(SR-C) IC15.P$13(SR-B) IC15.P$16(SR-A) IC17.8(B:QD) IC17.9(B:QC) IC50.11(QD) IC50.12(QC) IC50.13(QB) IC50.14(QA) IC51.11(QD) IC51.12(QC) IC51.13(QB) IC51.14(QA) OSC1.1(TS) SW3.P$3

## Notes on the sheet
- The OSHintosh, an Open Source SBC Macintosh
- Power On Reset and Switch | -5V Regulator | Onboard Power LED | Ferrite Voltage Rails | RTC Battery | RS422 Ports and Line Transcievers | Pull Up/Down Resistors | Sound Counter ICs | ATX Power Connector | Video Input Pulldowns
- Address Lines and TSEN signals
- System PALS:
  TSM, TSG, LAG, BMU0, BMU1, ASG
- 128 to 512 Address Decoder
  (Dr. Dobbs)
- Engineers Note:
  When testing, assemble and test POR first.
  It has been checked and appears good, but it's a little bit sketchy
- Engineers Note:
  Coin Cell Should Be able to power the ATTINY85
- Current Limiting Resistors
- Engineers Note:
  Board should work with a Pico ATX PSU, to make it a "double Pico" design. 
  Any other ATX power supply should be fine though.
- Engineers Note:
  Pull downs on the Mac Video Lines to form 
  potential dividers, just in case they're needed,
  otherwise DNF.
- RAS, CAS, RAM Address and System Clocks
- Video Output Shift Registers
- 15.6672mhz Oscillator
- Mouse Interface | ATTINY85 RTC | Keyboard Interface | ATX Power Switch | Composite Video
- Engineers Note:
  All of the PALs (BMU1 included) are intended to be replaced with GAL16V8s
- Engineers Note:
  This design was taken from the Dr. Dobbs article "how to fatten your Mac":
  https://dserver.macgui.com/Dr%20Dobbs%20Fatten%20Your%20Mac%201985.pdf
- 512K System DRAM (41256 ICs)
- Engineers Note:
  ATTINY85 has internal oscillator, 
  32.768khz added but may be DNF.
- Engineers Note:
  On board slide Power Switch, with the option for an off board toggle switch as well.
- Engineers Note:
  Composite video connector is entirely optional,
  but has been retained in case it's desired. 
  Ensure a jumper is fitted to CN4.
- Volume Control, Audio Amplifier and Headphone Connector | Zilog SCC Serial Controller | MOS 6522 VIA I/O Controller
- DRAM Video Address/Audio Address Multiplexers | Resistor Ladder DAC
- Assorted Inverters
- DRAM Video Address/System Address Multiplexers
- Engineers Note:
  VGA DAC, as based off the design as found in the "Hardware design with RP2040". 
  DAC's retained to allow for compatability with the optional composite output. 
  
  This board is designed to be compatible with the 128/512/Plus.  However, it should also work with the SE and SE/30. 
  Would not surprise me if it works with a Classic and Classic ii as well.
- 5.1V
  Zener
- Raspberry Pi Pico
- Engineers Note:
  Design identical to Sony SND THT design, which has been proven to work.
- Schwim Buffers, Resistor Array and Address Decode Logic | System ROMs and Address Logic | MC68000 CPU and Interrupt Switch
- Engineers Note:
  Assorted inverters, using a single 74ls04 hex inverter. 
  Note the sixth inverter is used for the Rominator Output Enable
- DRAM Data Bus Buffers
- N/A
- DosFox
- Video Address Counters
- Engineers Note:
  Pico Header and Pinout, again taken from the reference material.
  22R inline resistors for some protection. 
  Found that the video output from a plus board is only about 3-4v, within tolerance of a standard Pico. 
  R22, R23, R24 are present but DNF'd, in case they are needed (I.E, with an SE board)
- Engineers Note:
  Header for interrupt switch
- Engineers Note:
  The 74ls02 is also used as the decode logic for the onboard Rominator
  See Schwim Github for how this works. I still hate it.
- Engineers Note:
  Built in Rominator, to allow the system to boot from ROM.
- VGA Connector
- IC Power Rails | Decoupling Capacitors
- Engineers Note:
  It's a VGA port. What else do you want from me?
- Note: This design is based on the Pico VGA Scan Converter by GuruThree:
  https://github.com/guruthree/mac-se-video-converter
  
  VGA Interface is based off the RP2040 reference design:
  https://datasheets.raspberrypi.com/rp2040/hardware-design-with-rp2040.pdf

## Library data of the parts
A1 = Schematic Symbols:PROJECT_DETAILS
BATT1 = SparkFun-Batteries:BATTERY: Battery - Single Cell A variety of battery chemistries, sizes, and footprints. Device List: 20MM_PTH - Coin Cell Battery Holder - 20mm (PTH) <https://www.sparkfun.com/products/783> 12MM_SMD - Coin Cell Battery Holder - 12mm (SMD) <https://www.sparkfun.com/products/10592> 12MM_PTH - Coin Cell Battery Holder - 12mm (PTH) <https://www.sparkfun.com/products/7948> 20MM_SMD - 20mm Coin Cell Battery Holder (SMD) (2 legs) Used on the Big Time Watch Kit <https://www.sparkfun.com/products/11734> 20MM_SMD_4LEGS - Coin Cell Battery Holder - 20mm (SMD) <https://www.sparkfun.com/products/11892> 20MM_SMD_4LEGS_OVERPASTE - Coin Cell Battery Holder - 20mm (SMD) <https://www.sparkfun.com/products/11892> (Over-paste on the legs) 24.5MM_PTH - Coin Cell Battery Holder - 24.5mm (PTH) <https://www.sparkfun.com/products/8863> 9V - 9V Battery Holder - PC Mount Used on the SparkFun SparkPunk Sound Kit <https://www.sparkfun.com/products/11177> and SparkFun SparkPunk Sequencer Kit <https://www.sparkfun.com/products/12707> 18650 - Battery Holder - 18650 (PTH) <https://www.sparkfun.com/products/13113> AA - Battery Holder - 1xAA (PTH) <https://www.sparkfun.com/products/7949> AAA - Battery Holder - 1xAAA (PTH) <https://www.sparkfun.com/products/12718> AA_KIT - Battery Holder - 1xAA (PTH) <https://www.sparkfun.com/products/7949> Special kit package - pads only have exposed copper on one side of the board. AAA_KIT - Battery Holder - 1xAAA (PTH) <https://www.sparkfun.com/products/12718> Special kit package - pads only have exposed copper on one side of the board.; PROD_ID: BATT-09031; SF_SKU: PRT-00783
C1-C6 C9 C10 C19-C65 = Capacitors TH:100N_TH_CAP; COMPONENT: Capacitor; COST: =(INDIRECT(ADDRESS(ROW(),1)))*(INDIRECT(ADDRESS(ROW(),13))); EA: =VLOOKUP(INDIRECT(ADDRESS(ROW(),7)),[ProductCosts.xlsx]StockCosts!$A:$B,2,FALSE); KPN: 3101-100N; PACKAGE: 5.08mm PITCH; PROCESS: TH
C7 C12 C13 = Capacitors TH:470P_TH_CAP; COMPONENT: Capacitor; COST: =(INDIRECT(ADDRESS(ROW(),1)))*(INDIRECT(ADDRESS(ROW(),13))); EA: =VLOOKUP(INDIRECT(ADDRESS(ROW(),7)),[ProductCosts.xlsx]StockCosts!$A:$B,2,FALSE); KPN: 3101-470P; PACKAGE: 5.08mm PITCH; PROCESS: TH
C8 C16 C17 = Capacitors TH:1N_TH_CAP; COMPONENT: Capacitor; COST: =(INDIRECT(ADDRESS(ROW(),1)))*(INDIRECT(ADDRESS(ROW(),13))); EA: =VLOOKUP(INDIRECT(ADDRESS(ROW(),7)),[ProductCosts.xlsx]StockCosts!$A:$B,2,FALSE); KPN: 3101-1N; PACKAGE: 5.08mm PITCH; PROCESS: TH
C11 = Capacitors TH:220P_TH_CAP; COMPONENT: Capacitor; COST: =(INDIRECT(ADDRESS(ROW(),1)))*(INDIRECT(ADDRESS(ROW(),13))); EA: =VLOOKUP(INDIRECT(ADDRESS(ROW(),7)),[ProductCosts.xlsx]StockCosts!$A:$B,2,FALSE); KPN: 3101-220P; PACKAGE: 5.08mm PITCH; PROCESS: TH
C14 = Capacitors TH:2U2_TH_ELEC_CAP; COMPONENT: Capacitor Electrolytic; COST: =(INDIRECT(ADDRESS(ROW(),1)))*(INDIRECT(ADDRESS(ROW(),13))); EA: =VLOOKUP(INDIRECT(ADDRESS(ROW(),7)),[ProductCosts.xlsx]StockCosts!$A:$B,2,FALSE); KPN: 3102-2U2; PACKAGE: 5mm DIA; PROCESS: TH
C15 = Capacitors TH:1U_TH_ELEC_CAP; COMPONENT: Capacitor Electrolytic; COST: =(INDIRECT(ADDRESS(ROW(),1)))*(INDIRECT(ADDRESS(ROW(),13))); EA: =VLOOKUP(INDIRECT(ADDRESS(ROW(),7)),[ProductCosts.xlsx]StockCosts!$A:$B,2,FALSE); KPN: 3102-1U; PACKAGE: 5mm DIA; PROCESS: TH
C18 = Capacitors TH:1U_TH_ELEC_CAP; COMPONENT: Capacitor Electrolytic; COST: =(INDIRECT(ADDRESS(ROW(),1)))*(INDIRECT(ADDRESS(ROW(),13))); EA: =VLOOKUP(INDIRECT(ADDRESS(ROW(),7)),[ProductCosts.xlsx]StockCosts!$A:$B,2,FALSE); KPN: 3102-1U; PACKAGE: 5mm DIA; PROCESS: TH; VALUE: 1u 50V
C66 C68 = Capacitors TH:33P_TH_CAP; COMPONENT: Capacitor; COST: =(INDIRECT(ADDRESS(ROW(),1)))*(INDIRECT(ADDRESS(ROW(),13))); EA: =VLOOKUP(INDIRECT(ADDRESS(ROW(),7)),[ProductCosts.xlsx]StockCosts!$A:$B,2,FALSE); KPN: 3101-33P; PACKAGE: 5.08mm PITCH; PROCESS: TH; VALUE: 33p 100V
C67 = Capacitors TH:100U_TH_ELEC_CAP; COMPONENT: Capacitor Electrolytic; COST: =(INDIRECT(ADDRESS(ROW(),1)))*(INDIRECT(ADDRESS(ROW(),13))); EA: =VLOOKUP(INDIRECT(ADDRESS(ROW(),7)),[ProductCosts.xlsx]StockCosts!$A:$B,2,FALSE); KPN: 3102-100U; PACKAGE: 5mm DIA; PROCESS: TH; VALUE: 100u 16V
CN1 CN10 CN11 CN14 = Connectors:PIN_HEADER_2W_VERT_TH; COMPONENT: Pin Header (36way); COST: =(INDIRECT(ADDRESS(ROW(),1)))*(INDIRECT(ADDRESS(ROW(),13))); EA: =(VLOOKUP(INDIRECT(ADDRESS(ROW(),6)),'[ProductCosts.xlsx]StockCosts'!$A:$B,2,FALSE)/(36/(LEFT(INDIRECT(ADDRESS(ROW(),8)),SUM(LEN(INDIRECT(ADDRESS(ROW(),8)))-LEN(SUBSTITUTE(INDIRECT(ADDRESS(ROW(),8)),{"0","1","2","3","4","5","6","7","8","9"},""))))))); KPN: 4133; PACKAGE: 2.54mm pitch; PROCESS: TH
CN2-CN4 = SparkFun-Connectors:DB9: DB9 Connector Standard DB9 (D-Sub 9) serial connector. Can be used for CAN bus as well as RS485 and RS232. Footprint production proven. Here is the female version connector we sell at SparkFun: 9 Pin Female Serial Connector - PCB Mount <https://www.sparkfun.com/products/429> (PRT-00429) This connector has been used on the following SparkFun products: SparkFun RS232 Shifter - SMD <https://www.sparkfun.com/products/449> (PRT-00449) SparkFun RS232 Shifter SMD (No DB9) <https://www.sparkfun.com/products/8780> (PRT-08780); PROD_ID: CONN-08194
CN5 = con-xmultiple:XRJK*4: RJ11 Connector without LED, 6 position, 4 contacts, thrue hole Source: XRJK-S-01-6-4-0-9M2(01).pdf
CN6 = SparkFun-Connectors:AUDIO_JACK_3.5MM: Audio Jack 3.5mm variants of PTH and SMT stereo audio jack with bypass switches. SparkFun Products: SparkFun SparkPunk Sound Kit <[https://www.sparkfun.com/products/11177]> - PTH MP3 Trigger <https://www.sparkfun.com/products/13720> -3.5mm SMD SparkFun PicoBoard <https://www.sparkfun.com/products/11888>- 2.5mm SMD; PROD_ID: CONN-08774; SF_ID: PRT-08032
CN7 = uProcessor:PICO_BOARD; COMPONENT: Pico Connector; COST: =(INDIRECT(ADDRESS(ROW(),1)))*(INDIRECT(ADDRESS(ROW(),13)))*2; DATASHEET: https://www.toby.co.uk/uploads/publications/2009.pdf; DETAILS: BOARD REQUIRES 2 CONNECTORS; EA: =VLOOKUP(INDIRECT(ADDRESS(ROW(),7)),[ProductCosts.xlsx]StockCosts!$A:$B,2,FALSE); KPN: 4189; PACKAGE: 2.54mm 20-way; PROCESS: TH
CN8 = SparkFun-Retired:DB15: DB15 / VGA right angle through-hole female connector.
CN9 = SparkFun-Connectors:ATX24: ATX24 Pin Power Supply Connector - Right Angle PTH Mount This is a good connector for connecting a computer power supply to a PCB. It's massive, but provides many amps of power at 5V and 12V. SparkFun Products: SparkFun Benchtop Power Board Kit <https://www.sparkfun.com/products/12867> SparkFun Power Driver Shield Kit <https://www.sparkfun.com/products/10618>; PROD_ID: CONN-09674; SF_ID: PRT-09498
CN12 = SparkFun-Connectors:RCA: RCA Jack connector This is a right angle RCA jack connecotr. Commonly used for video or audio. Here is the connector we sell at SparkFun: RCA Jack <https://www.sparkfun.com/products/8631> (PRT-08631) Datasheet <http://www.sparkfun.com/datasheets/Prototyping/Connectors/RCA-Jack.pdf> It is not used on any active designs, however it was used on a couple retired products: RCA Jack Breakout [RETIRED] <https://www.sparkfun.com/products/8826> (PRT-08826) SparkFun On Screen Display Breakout - MAX7456 [RETIRED] <https://www.sparkfun.com/products/9168> (BOB-09168) You may also be interested in a cable: RCA Video Cable - 6' <https://www.sparkfun.com/products/11573> (CAB-11573); PROD_ID: CONN-09081; SF_ID: PRT-08631
CN13 = Connectors:PIN_HEADER_3W_VERT_FEMALE_TH; COMPONENT: Pin Header Socket (3 Way); COST: =(INDIRECT(ADDRESS(ROW(),1)))*(INDIRECT(ADDRESS(ROW(),13))); DATASHEET: https://www.toby.co.uk/uploads/publications/2009.pdf; EA: =VLOOKUP(INDIRECT(ADDRESS(ROW(),7)),[ProductCosts.xlsx]StockCosts!$A:$B,2,FALSE); KPN: 4182; MANUFACTURE: Toby; PACKAGE: 2.54mm Pitch; PROCESS: TH
D1 = diode:ZENER-DIODE: Z-Diode
D2 = diode:1N4148: DIODE high speed (Philips)
D3 = Optoelectronics:5MM_LED_RED; COMPONENT: LED; COST: =(INDIRECT(ADDRESS(ROW(),1)))*(INDIRECT(ADDRESS(ROW(),13))); EA: =VLOOKUP(INDIRECT(ADDRESS(ROW(),7)),[ProductCosts.xlsx]StockCosts!$A:$B,2,FALSE); KPN: 3504; PACKAGE: 5mm Dia; PROCESS: TH
D4 D5 = adafruit:1N4004: DIODE General purpose 1N400x type rectifier (With bigger pads) http://www.ladyada.net/library/pcb/eaglelibrary.html
FB1 FB2 = adafruit:FB: Ferrite bead Digikey #P9821BK-ND
IC1 = micro-mc68000:MC68000P: 68xxx PROCESSOR; OC_FARNELL: unknown; OC_NEWARK: unknown
IC2 IC3 IC5-IC7 = pal:16V8: PAL; MPN: GAL16V8D-7LPN; OC_FARNELL: 9699740; OC_NEWARK: 97K0449
IC4 = linear:LM311: COMPARATOR
IC8 = pal:16L8: PAL; MF: TEXAS INSTRUMENTS; MPN: TIBPAL16L8-7CN; OC_FARNELL: 1510033; OC_NEWARK: 08F8522
IC9 IC10 IC48 = 74xx-eu:74*244: Octal BUFFER and LINE DRIVER, 3-state
IC11 = ICs:Z85C30
IC12 IC13 = 74xx-eu:74*257: Quadruple 2-to 1 line data SELECTOR/MULTIPLEXER
IC14 IC18-IC21 = 74xx-eu:74*253: Dual 4-to 1 line data SELECTOR/MULTIPLEXER, 3-state
IC15 = ICs:AM26LS30
IC16 IC17 = 74xx-eu:74*393: Dual 4-bit decade and binary COUNTER
IC22 = ICs:AM26LS32
IC23 IC24 = 74xx-eu:74*166: 8-bit parallel load SHIFT REGISTER
IC25-IC40 = memory-nec:41256C/D: MEMORY; OC_FARNELL: unknown; OC_NEWARK: unknown
IC41 IC42 = memory-sst:SST39SF040A: 4 Mbit x8 Multi-Purpose Flash Source: http://www.sst.com/dotAsset/40782.pdf
IC43 = linear:TL072: OP AMP
IC44 = 40xx:4016: Quad bilateral ANALOG SWITCH
IC45 = 74xx-eu:74*04: Hex INVERTER
IC46 = 65XXX:G65SC22P
IC47 = SparkFun-Retired:ATTINY45: Atmel 8-pin 2/4/8kB flash uC Retired; PROD_ID: IC-09445; VALUE: TINY85-20-DIP
IC49 = 74xx-us:74*02: Quad 2-input NOR gate
IC50 IC51 = 74ttl-din:74*161: Synchrounus 4-bit COUNTER
OSC1 = crystal:XO-: CRYSTAL; OC_FARNELL: unknown; OC_NEWARK: unknown
OSC2 = SparkFun-Clocks:CRYSTAL-32.768KHZ: 32.768kHz Crystal Frequency: 32.768kHz Frequency Stability: ±20ppm Load Capacitance: 12.5pF (PTH-2X6 & SMD-3.2X1.5), 6pF (SMD-2X6) SparkFun Products: SparkFun BigTime Watch Kit <https://www.sparkfun.com/products/11734> SparkFun nRF52832 Breakout <https://www.sparkfun.com/products/13990> SparkFun Real Time Clock Module <https://www.sparkfun.com/products/12708>; PROD_ID: XTAL-10112
Q1 = transistor-pnp:2N3906: PNP Transistor
Q2 = transistor-small-signal:2N3904: NPN TRANSISTOR
R1 = Resistors TH:470R_TH_RESISTOR; COMPONENT: Resistor; COST: =(INDIRECT(ADDRESS(ROW(),1)))*(INDIRECT(ADDRESS(ROW(),13))); EA: =(VLOOKUP(INDIRECT(ADDRESS(ROW(),6)),[ProductCosts.xlsx]StockCosts!$A:$B,2,FALSE))/1000; KPN: 3004-470R; PACKAGE: Axial Leaded; PROCESS: TH
R2 R14-R20 = Resistors TH:4K7_TH_RESISTOR; COMPONENT: Resistor; COST: =(INDIRECT(ADDRESS(ROW(),1)))*(INDIRECT(ADDRESS(ROW(),13))); EA: =(VLOOKUP(INDIRECT(ADDRESS(ROW(),6)),[ProductCosts.xlsx]StockCosts!$A:$B,2,FALSE))/1000; KPN: 3004-4k7; PACKAGE: Axial Leaded; PROCESS: TH
R3 = Resistors TH:6K8_TH_RESISTOR; COMPONENT: Resistor; COST: =(INDIRECT(ADDRESS(ROW(),1)))*(INDIRECT(ADDRESS(ROW(),13))); EA: =(VLOOKUP(INDIRECT(ADDRESS(ROW(),6)),[ProductCosts.xlsx]StockCosts!$A:$B,2,FALSE))/1000; KPN: 3004-6k8; PACKAGE: Axial Leaded; PROCESS: TH
R4 R6 R70 = Resistors TH:47K_TH_RESISTOR; COMPONENT: Resistor; COST: =(INDIRECT(ADDRESS(ROW(),1)))*(INDIRECT(ADDRESS(ROW(),13))); EA: =(VLOOKUP(INDIRECT(ADDRESS(ROW(),6)),[ProductCosts.xlsx]StockCosts!$A:$B,2,FALSE))/1000; KPN: 3004-47k; PACKAGE: Axial Leaded; PROCESS: TH
R5 R33 R54 R74 R84 R89 R94 = Resistors TH:1K_TH_RESISTOR; COMPONENT: Resistor; COST: =(INDIRECT(ADDRESS(ROW(),1)))*(INDIRECT(ADDRESS(ROW(),13))); EA: =(VLOOKUP(INDIRECT(ADDRESS(ROW(),6)),[ProductCosts.xlsx]StockCosts!$A:$B,2,FALSE))/1000; KPN: 3004-1k; PACKAGE: Axial Leaded; PROCESS: TH
R7 = Resistors TH:68K_TH_RESISTOR; COMPONENT: Resistor; COST: =(INDIRECT(ADDRESS(ROW(),1)))*(INDIRECT(ADDRESS(ROW(),13))); EA: =(VLOOKUP(INDIRECT(ADDRESS(ROW(),6)),[ProductCosts.xlsx]StockCosts!$A:$B,2,FALSE))/1000; KPN: 3004-68k; PACKAGE: Axial Leaded; PROCESS: TH
R8 = Resistors TH:150K_TH_RESISTOR; COMPONENT: Resistor; COST: =(INDIRECT(ADDRESS(ROW(),1)))*(INDIRECT(ADDRESS(ROW(),13))); EA: =(VLOOKUP(INDIRECT(ADDRESS(ROW(),6)),[ProductCosts.xlsx]StockCosts!$A:$B,2,FALSE))/1000; KPN: 3004-150k; PACKAGE: Axial Leaded; PROCESS: TH
R9 R10 = Resistors TH:470K_TH_RESISTOR; COMPONENT: Resistor; COST: =(INDIRECT(ADDRESS(ROW(),1)))*(INDIRECT(ADDRESS(ROW(),13))); EA: =(VLOOKUP(INDIRECT(ADDRESS(ROW(),6)),[ProductCosts.xlsx]StockCosts!$A:$B,2,FALSE))/1000; KPN: 3004-470k; PACKAGE: Axial Leaded; PROCESS: TH
R11 = Resistors TH:100K_TH_RESISTOR; COMPONENT: Resistor; COST: =(INDIRECT(ADDRESS(ROW(),1)))*(INDIRECT(ADDRESS(ROW(),13))); EA: =(VLOOKUP(INDIRECT(ADDRESS(ROW(),6)),[ProductCosts.xlsx]StockCosts!$A:$B,2,FALSE))/1000; KPN: 3004-100k; PACKAGE: Axial Leaded; PROCESS: TH; VALUE: 100k
R12 = Resistors TH:150K_TH_RESISTOR; COMPONENT: Resistor; COST: =(INDIRECT(ADDRESS(ROW(),1)))*(INDIRECT(ADDRESS(ROW(),13))); EA: =(VLOOKUP(INDIRECT(ADDRESS(ROW(),6)),[ProductCosts.xlsx]StockCosts!$A:$B,2,FALSE))/1000; KPN: 3004-150k; PACKAGE: Axial Leaded; PROCESS: TH; VALUE: 150k
R13 = Resistors TH:10R_TH_RESISTOR; COMPONENT: Resistor; COST: =(INDIRECT(ADDRESS(ROW(),1)))*(INDIRECT(ADDRESS(ROW(),13))); EA: =(VLOOKUP(INDIRECT(ADDRESS(ROW(),6)),[ProductCosts.xlsx]StockCosts!$A:$B,2,FALSE))/1000; KPN: 3004-10R; PACKAGE: Axial Leaded; PROCESS: TH; VALUE: 10R
R21-R31 R34 R55-R58 R76 R79 R80 R82 R83 = Resistors TH:47R_TH_RESISTOR; COMPONENT: Resistor; COST: =(INDIRECT(ADDRESS(ROW(),1)))*(INDIRECT(ADDRESS(ROW(),13))); EA: =(VLOOKUP(INDIRECT(ADDRESS(ROW(),6)),[ProductCosts.xlsx]StockCosts!$A:$B,2,FALSE))/1000; KPN: 3004-47R; PACKAGE: Axial Leaded; PROCESS: TH
R32 R59-R67 = Resistors TH:2K2_TH_RESISTOR; COMPONENT: Resistor; COST: =(INDIRECT(ADDRESS(ROW(),1)))*(INDIRECT(ADDRESS(ROW(),13))); EA: =(VLOOKUP(INDIRECT(ADDRESS(ROW(),6)),[ProductCosts.xlsx]StockCosts!$A:$B,2,FALSE))/1000; KPN: 3004-2k2; PACKAGE: Axial Leaded; PROCESS: TH
R35 R36 R40 R43 R77 R78 = Resistors TH:3K3_TH_RESISTOR; COMPONENT: Resistor; COST: =(INDIRECT(ADDRESS(ROW(),1)))*(INDIRECT(ADDRESS(ROW(),13))); EA: =(VLOOKUP(INDIRECT(ADDRESS(ROW(),6)),[ProductCosts.xlsx]StockCosts!$A:$B,2,FALSE))/1000; KPN: 3004-3k3; PACKAGE: Axial Leaded; PROCESS: TH
R37-R39 R41 R42 R44-R53 R68 R69 R99-R101 = Resistors TH:22R_TH_RESISTOR; COMPONENT: Resistor; COST: =(INDIRECT(ADDRESS(ROW(),1)))*(INDIRECT(ADDRESS(ROW(),13))); EA: =(VLOOKUP(INDIRECT(ADDRESS(ROW(),6)),[ProductCosts.xlsx]StockCosts!$A:$B,2,FALSE))/1000; KPN: 3004-22R; PACKAGE: Axial Leaded; PROCESS: TH
R71 = Resistors TH:680R_TH_RESISTOR; COMPONENT: Resistor; COST: =(INDIRECT(ADDRESS(ROW(),1)))*(INDIRECT(ADDRESS(ROW(),13))); EA: =(VLOOKUP(INDIRECT(ADDRESS(ROW(),6)),[ProductCosts.xlsx]StockCosts!$A:$B,2,FALSE))/1000; KPN: 3004-680R; PACKAGE: Axial Leaded; PROCESS: TH
R72 R102-R104 = Resistors TH:22R_TH_RESISTOR; COMPONENT: Resistor; COST: =(INDIRECT(ADDRESS(ROW(),1)))*(INDIRECT(ADDRESS(ROW(),13))); EA: =(VLOOKUP(INDIRECT(ADDRESS(ROW(),6)),[ProductCosts.xlsx]StockCosts!$A:$B,2,FALSE))/1000; KPN: 3004-22R; PACKAGE: Axial Leaded; PROCESS: TH; VALUE: 22R
R73 = Resistors TH:100K_TH_RESISTOR; COMPONENT: Resistor; COST: =(INDIRECT(ADDRESS(ROW(),1)))*(INDIRECT(ADDRESS(ROW(),13))); EA: =(VLOOKUP(INDIRECT(ADDRESS(ROW(),6)),[ProductCosts.xlsx]StockCosts!$A:$B,2,FALSE))/1000; KPN: 3004-100k; PACKAGE: Axial Leaded; PROCESS: TH
R85 R90 R95 = Resistors TH:2K2_TH_RESISTOR; COMPONENT: Resistor; COST: =(INDIRECT(ADDRESS(ROW(),1)))*(INDIRECT(ADDRESS(ROW(),13))); EA: =(VLOOKUP(INDIRECT(ADDRESS(ROW(),6)),[ProductCosts.xlsx]StockCosts!$A:$B,2,FALSE))/1000; KPN: 3004-2k2; PACKAGE: Axial Leaded; PROCESS: TH; VALUE: 2k2
R86 R91 R96 = Resistors TH:4K7_TH_RESISTOR; COMPONENT: Resistor; COST: =(INDIRECT(ADDRESS(ROW(),1)))*(INDIRECT(ADDRESS(ROW(),13))); EA: =(VLOOKUP(INDIRECT(ADDRESS(ROW(),6)),[ProductCosts.xlsx]StockCosts!$A:$B,2,FALSE))/1000; KPN: 3004-4k7; PACKAGE: Axial Leaded; PROCESS: TH; VALUE: 4k7
R87 R92 R97 = Resistors TH:68K_TH_RESISTOR; COMPONENT: Resistor; COST: =(INDIRECT(ADDRESS(ROW(),1)))*(INDIRECT(ADDRESS(ROW(),13))); EA: =(VLOOKUP(INDIRECT(ADDRESS(ROW(),6)),[ProductCosts.xlsx]StockCosts!$A:$B,2,FALSE))/1000; KPN: 3004-68k; PACKAGE: Axial Leaded; PROCESS: TH; VALUE: 68k
R88 R93 R98 = Resistors TH:470R_TH_RESISTOR; COMPONENT: Resistor; COST: =(INDIRECT(ADDRESS(ROW(),1)))*(INDIRECT(ADDRESS(ROW(),13))); EA: =(VLOOKUP(INDIRECT(ADDRESS(ROW(),6)),[ProductCosts.xlsx]StockCosts!$A:$B,2,FALSE))/1000; KPN: 3004-470R; PACKAGE: Axial Leaded; PROCESS: TH; VALUE: 470R
SW1 SW2 = Switches:DIP_TACT_SWITCH_6X6; COMPONENT: Switch; COST: =(INDIRECT(ADDRESS(ROW(),1)))*(INDIRECT(ADDRESS(ROW(),13))); DATASHEET: https://www.kitronik.co.uk/pdf/tact_switch_6mm.pdf; EA: =VLOOKUP(INDIRECT(ADDRESS(ROW(),7)),[ProductCosts.xlsx]StockCosts!$A:$B,2,FALSE); KPN: 3420; MANUFACTURE: Diptronics; PACKAGE: 6mm x 6mm; PROCESS: TH
SW3 = Switches:SS12D16-GDN5; COMPONENT: Switch; COST: =(INDIRECT(ADDRESS(ROW(),1)))*(INDIRECT(ADDRESS(ROW(),13))); EA: =VLOOKUP(INDIRECT(ADDRESS(ROW(),7)),[ProductCosts.xlsx]StockCosts!$A:$B,2,FALSE); KPN: 3415; PROCESS: TH
VREG1 = linear:79*: Negative VOLTAGE REGULATOR